# EAGLE schematic MJ838 - rev.1b (EAGLE 9.6.2)
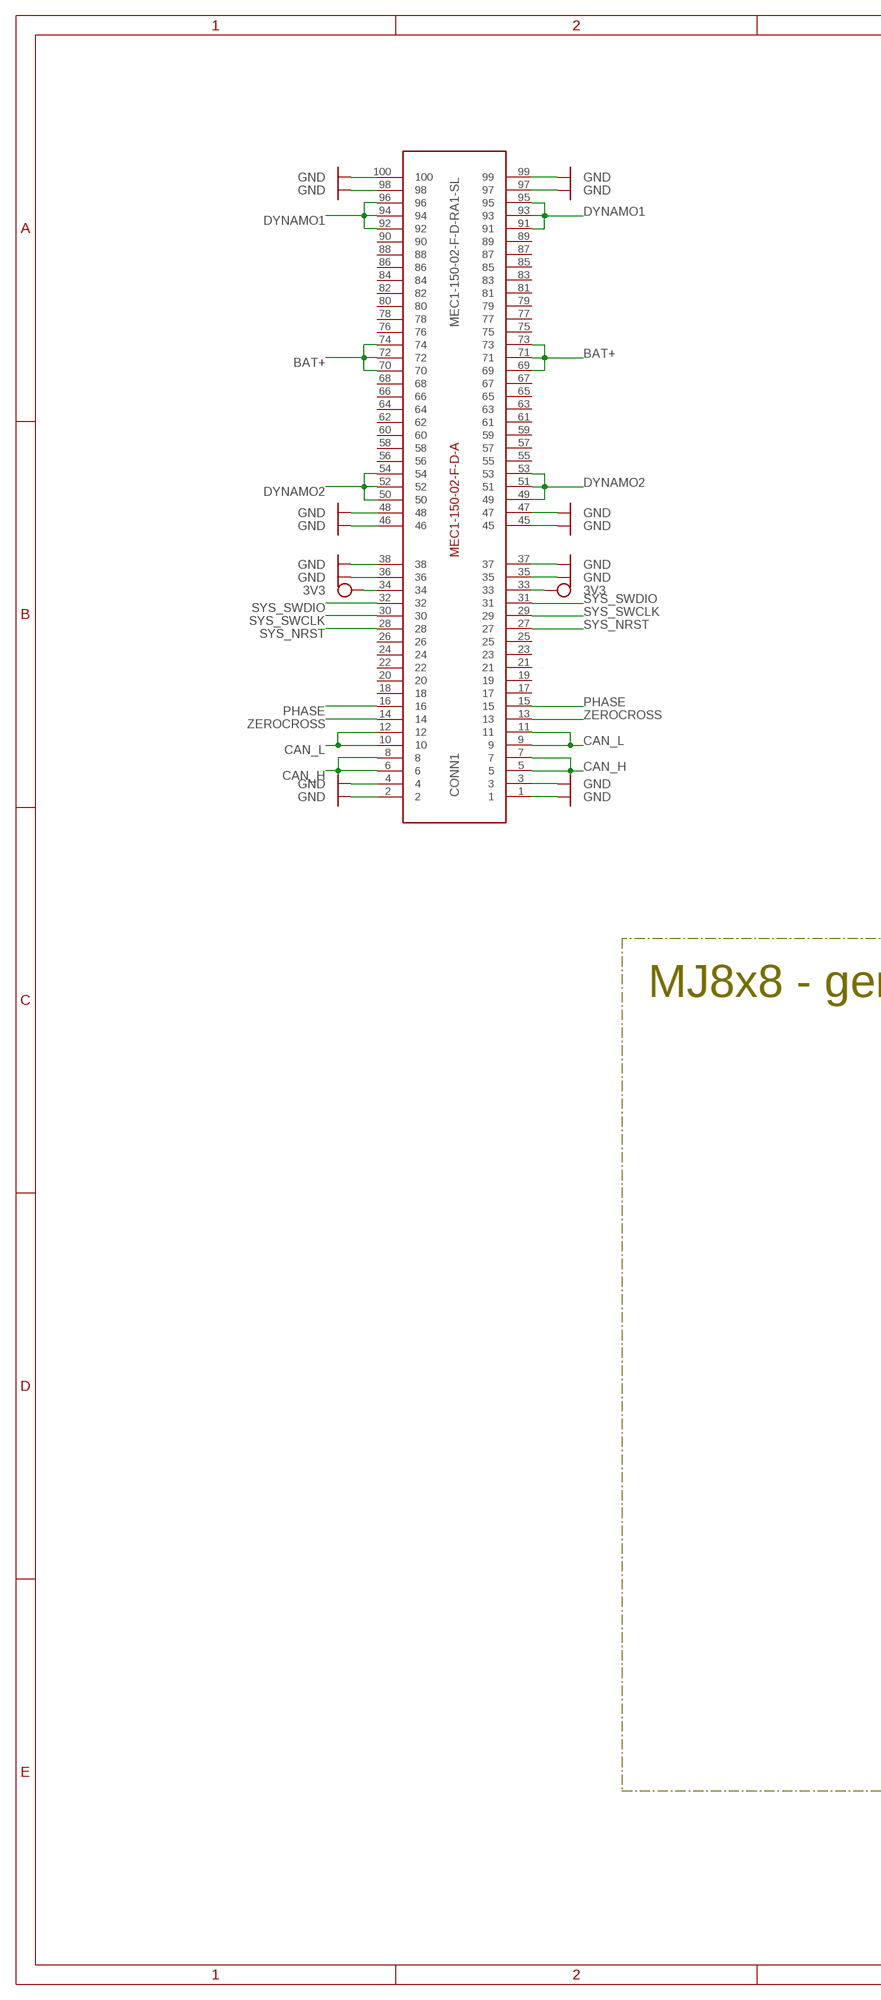
[diagram p0: schematic, sheet 1, part 1 of 2]
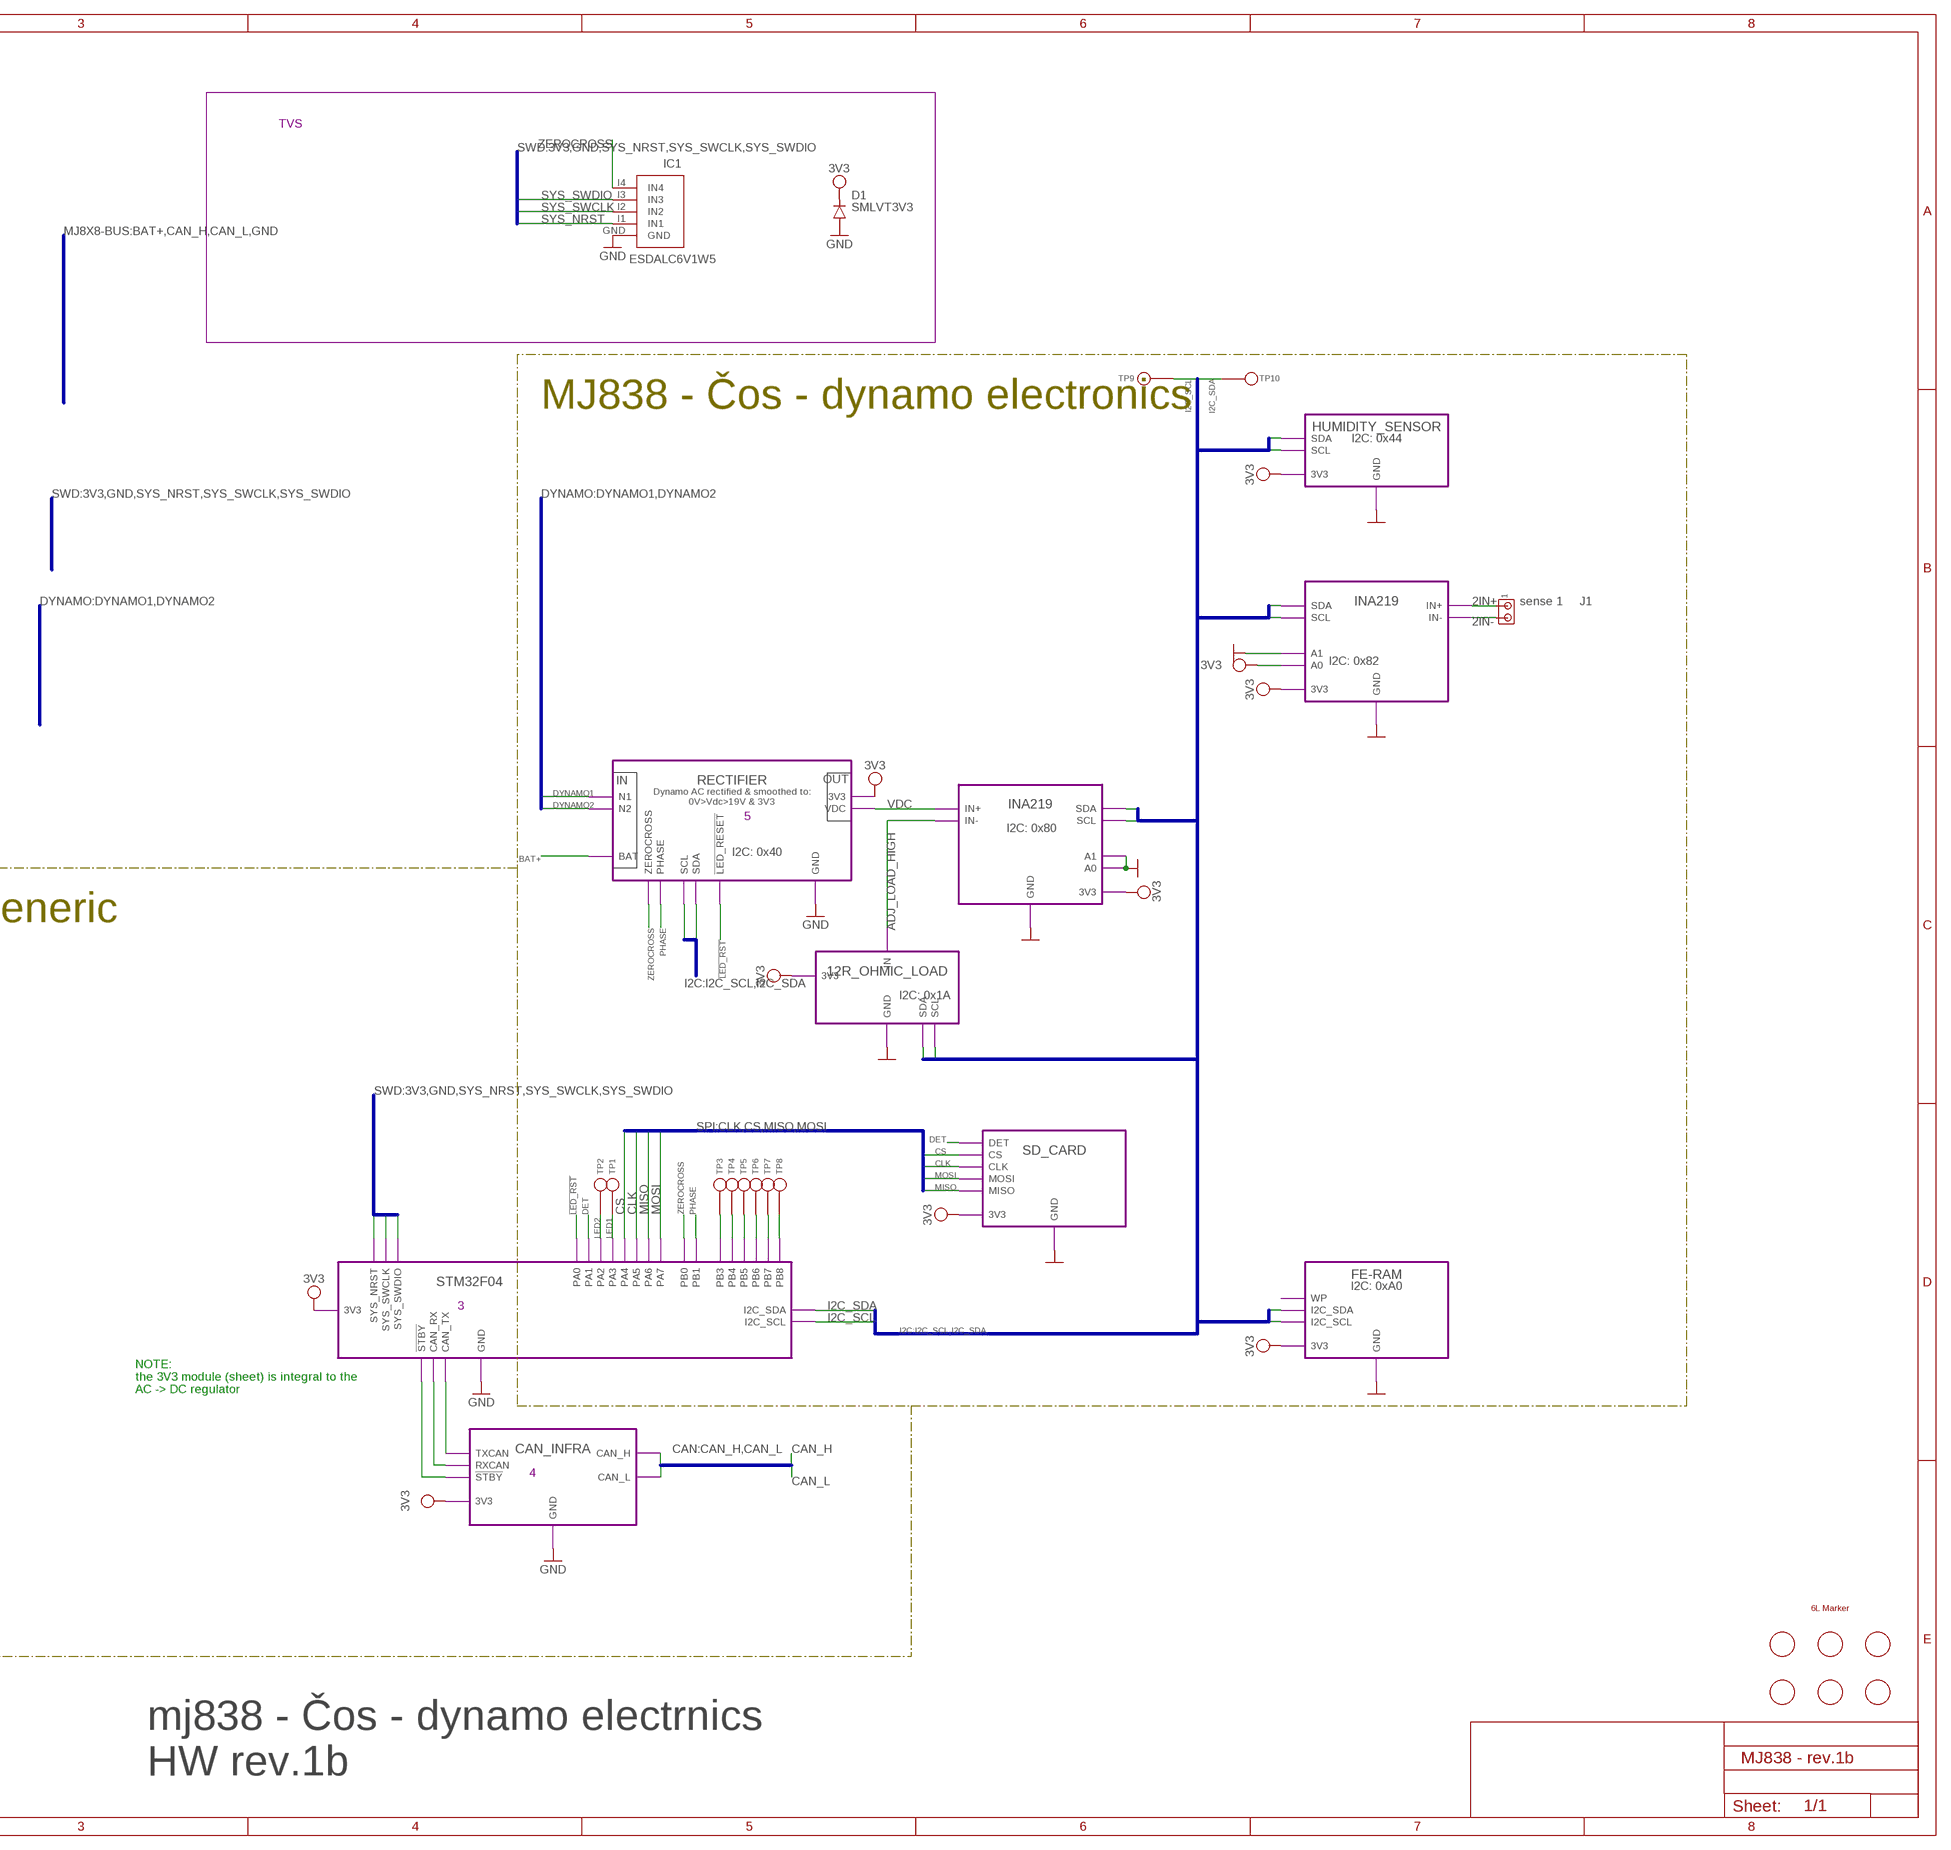
[diagram p1: schematic, sheet 1, part 2 of 2]

## Parts
CONN1  MEC1-150-02-F-D-RA1-SL  CARD-EDGE  [SMD]
D1  SMLVT3V3  DIODE-SMB  [SMB]
FID1  n/a  FIDUCIALFID_1MM  [FIDUCIAL_1MM]
FID2  n/a  FIDUCIALFID_1MM  [FIDUCIAL_1MM]
FID3  n/a  FIDUCIALFID_1MM  [FIDUCIAL_1MM]
FID4  n/a  FIDUCIALFID_1MM  [FIDUCIAL_1MM]
FID5  n/a  FIDUCIALFID_1MM  [FIDUCIAL_1MM]
FID6  n/a  FIDUCIALFID_1MM  [FIDUCIAL_1MM]
IC1  ESDALC6V1W5  ESDALC6  [SOT323-5]
J1  sense 1  MTA02-100  [10X02MTA]
MARKER1  6 layer  6L  [6L]
TP1  CAN high  TPTH-0.9  [TH-0.9]
TP2  CAN high  TPTH-0.9  [TH-0.9]
TP3  CAN high  TPTH-0.9  [TH-0.9]
TP4  CAN high  TPTH-0.9  [TH-0.9]
TP5  CAN high  TPTH-0.9  [TH-0.9]
TP6  CAN high  TPTH-0.9  [TH-0.9]
TP7  CAN high  TPTH-0.9  [TH-0.9]
TP8  CAN high  TPTH-0.9  [TH-0.9]
TP9  CAN high  TPTH-0.9  [TH-0.9]
TP10  CAN high  TPTH-0.9  [TH-0.9]

## Module instances
STM32F04 = STM32
CAN_INFRA = CAN_INFRA
RECTIFIER = RECTIFIER
12R_OHMIC_LOAD = 12R_OHMIC_LOAD
FE-RAM = FE-RAM
HUMIDITY_SENSOR = HUMIDITY
INA219 = INA219
INA1 = INA219
SD_CARD = SD_CARD

## Nets
2IN+ [signal]: J1.1 ; port INA1.IN+
2IN- [signal]: J1.2 ; port INA1.IN-
3V3 [3V3]: CONN1.33 CONN1.34 D1.C ; port STM32F04.3V3 CAN_INFRA.3V3 RECTIFIER.3V3 FE-RAM.3V3 HUMIDITY_SENSOR.3V3 12R_OHMIC_LOAD.3V3 INA219.3V3 INA1.3V3 INA1.A0 SD_CARD.3V3
!LED_RST! [signal]: port RECTIFIER.!LED_RESET! STM32F04.PA0
!STBY! [signal]: port CAN_INFRA.!STBY! STM32F04.!STBY!
ADJ_LOAD_HIGH [Vdc]: port 12R_OHMIC_LOAD.IN INA219.IN-
BAT+ [BAT+]: CONN1.69 CONN1.70 CONN1.71 CONN1.72 CONN1.73 CONN1.74 ; port RECTIFIER.BAT
CAN_H [signal]: CONN1.5 CONN1.6 CONN1.7 CONN1.8 ; port CAN_INFRA.CAN_H
CAN_L [signal]: CONN1.9 CONN1.10 CONN1.11 CONN1.12 ; port CAN_INFRA.CAN_L
CAN_RX [signal]: port CAN_INFRA.RXCAN STM32F04.CAN_RX
CAN_TX [signal]: port CAN_INFRA.TXCAN STM32F04.CAN_TX
CLK: port STM32F04.PA5 SD_CARD.CLK
CS: port STM32F04.PA4 SD_CARD.CS
DET: port SD_CARD.DET STM32F04.PA1
DYNAMO1 [Vdynamo]: CONN1.91 CONN1.92 CONN1.93 CONN1.94 CONN1.95 CONN1.96 ; port RECTIFIER.N1
DYNAMO2 [Vdynamo]: CONN1.49 CONN1.50 CONN1.51 CONN1.52 CONN1.53 CONN1.54 ; port RECTIFIER.N2
GND: CONN1.1 CONN1.2 CONN1.3 CONN1.4 CONN1.35 CONN1.36 CONN1.37 CONN1.38 CONN1.45 CONN1.46 CONN1.47 CONN1.48 CONN1.97 CONN1.98 CONN1.99 CONN1.100 D1.A IC1.GND ; port STM32F04.GND CAN_INFRA.GND RECTIFIER.GND 12R_OHMIC_LOAD.GND FE-RAM.GND HUMIDITY_SENSOR.GND INA219.GND INA219.A1 INA219.A0 INA1.GND INA1.A1 SD_CARD.GND
I2C_SCL [signal]: TP9.P$1(TP$1) ; port FE-RAM.I2C_SCL STM32F04.I2C_SCL HUMIDITY_SENSOR.SCL RECTIFIER.SCL 12R_OHMIC_LOAD.SCL INA219.SCL INA1.SCL
I2C_SDA [signal]: TP10.P$1(TP$1) ; port FE-RAM.I2C_SDA STM32F04.I2C_SDA HUMIDITY_SENSOR.SDA RECTIFIER.SDA 12R_OHMIC_LOAD.SDA INA219.SDA INA1.SDA
LED1: TP1.P$1(TP$1) ; port STM32F04.PA3
LED2: TP2.P$1(TP$1) ; port STM32F04.PA2
MISO: port STM32F04.PA6 SD_CARD.MISO
MOSI: port STM32F04.PA7 SD_CARD.MOSI
PB3: TP3.P$1(TP$1) ; port STM32F04.PB3
PB4: TP4.P$1(TP$1) ; port STM32F04.PB4
PB5: TP5.P$1(TP$1) ; port STM32F04.PB5
PB6: TP6.P$1(TP$1) ; port STM32F04.PB6
PB7: TP7.P$1(TP$1) ; port STM32F04.PB7
PB8: TP8.P$1(TP$1) ; port STM32F04.PB8
PHASE [signal]: CONN1.15 CONN1.16 ; port RECTIFIER.PHASE STM32F04.PB1
SYS_NRST [signal]: CONN1.27 CONN1.28 IC1.I1(IN1) ; port STM32F04.SYS_NRST
SYS_SWCLK [signal]: CONN1.29 CONN1.30 IC1.I2(IN2) ; port STM32F04.SYS_SWCLK
SYS_SWDIO [signal]: CONN1.31 CONN1.32 IC1.I3(IN3) ; port STM32F04.SYS_SWDIO
VDC [Vdc]: port RECTIFIER.VDC INA219.IN+
ZEROCROSS [signal]: CONN1.13 CONN1.14 IC1.I4(IN4) ; port STM32F04.PB0 RECTIFIER.ZEROCROSS
Unconnected: CONN1.17 CONN1.18 CONN1.19 CONN1.20 CONN1.21 CONN1.22 CONN1.23 CONN1.24 CONN1.25 CONN1.26 CONN1.55 CONN1.56 CONN1.57 CONN1.58 CONN1.59 CONN1.60 CONN1.61 CONN1.62 CONN1.63 CONN1.64 CONN1.65 CONN1.66 CONN1.67 CONN1.68 CONN1.75 CONN1.76 CONN1.77 CONN1.78 CONN1.79 CONN1.80 CONN1.81 CONN1.82 CONN1.83 CONN1.84 CONN1.85 CONN1.86 CONN1.87 CONN1.88 CONN1.89 CONN1.90

## Buses
CAN:CAN_H,CAN_L
SWD:3V3,GND,SYS_NRST,SYS_SWCLK,SYS_SWDIO
I2C:I2C_SCL,I2C_SDA
MJ8X8-BUS:BAT+,CAN_H,CAN_L,GND
DYNAMO:DYNAMO1,DYNAMO2
SPI:CLK,CS,MISO,MOSI

## Notes on the sheet
- TVS
- MJ838 - Čos - dynamo electronics
- I2C: 0x44
- I2C: 0x82
- IN | OUT
- Dynamo AC rectified & smoothed to:
  0V>Vdc>19V & 3V3
- 5
- I2C: 0x80
- I2C: 0x40
- MJ8x8 - generic
- I2C: 0x1A
- I2C: 0xA0
- 3
- NOTE:
  the 3V3 module (sheet) is integral to the
  AC -> DC regulator
- 4
- mj838 - Čos - dynamo electrnics
  HW rev.1b

## Library data of the parts
CONN1 = Samtec MEC1 - Card Edge Connector:CARD-EDGE
D1 = diode:DIODE-: DIODE
FID1-FID6 = fiducials:FIDUCIAL
IC1 = ESDALCx - 4c ESD protection:ESDALC6
J1 = con-amp:MTA02-100: AMP connector
MARKER1 = Layer Markers:6L
TP1-TP10 = signal testpoint:TP

## Module STM32
Ports: GND(pwr) 3V3(pwr) SYS_NRST(in) SYS_SWCLK(io) SYS_SWDIO(io) CAN_RX(in) CAN_TX(out) !STBY!(out) I2C_SCL(out) I2C_SDA(io) PB1(in) PB3(io) PB4(io) PB5(io) PB6(io) PB7(io) PB8(io) PB0(in) PA0(out) PA1(io) PA7(out) PA2(io) PA3(io) PA4(io) PA5(io) PA6(io)
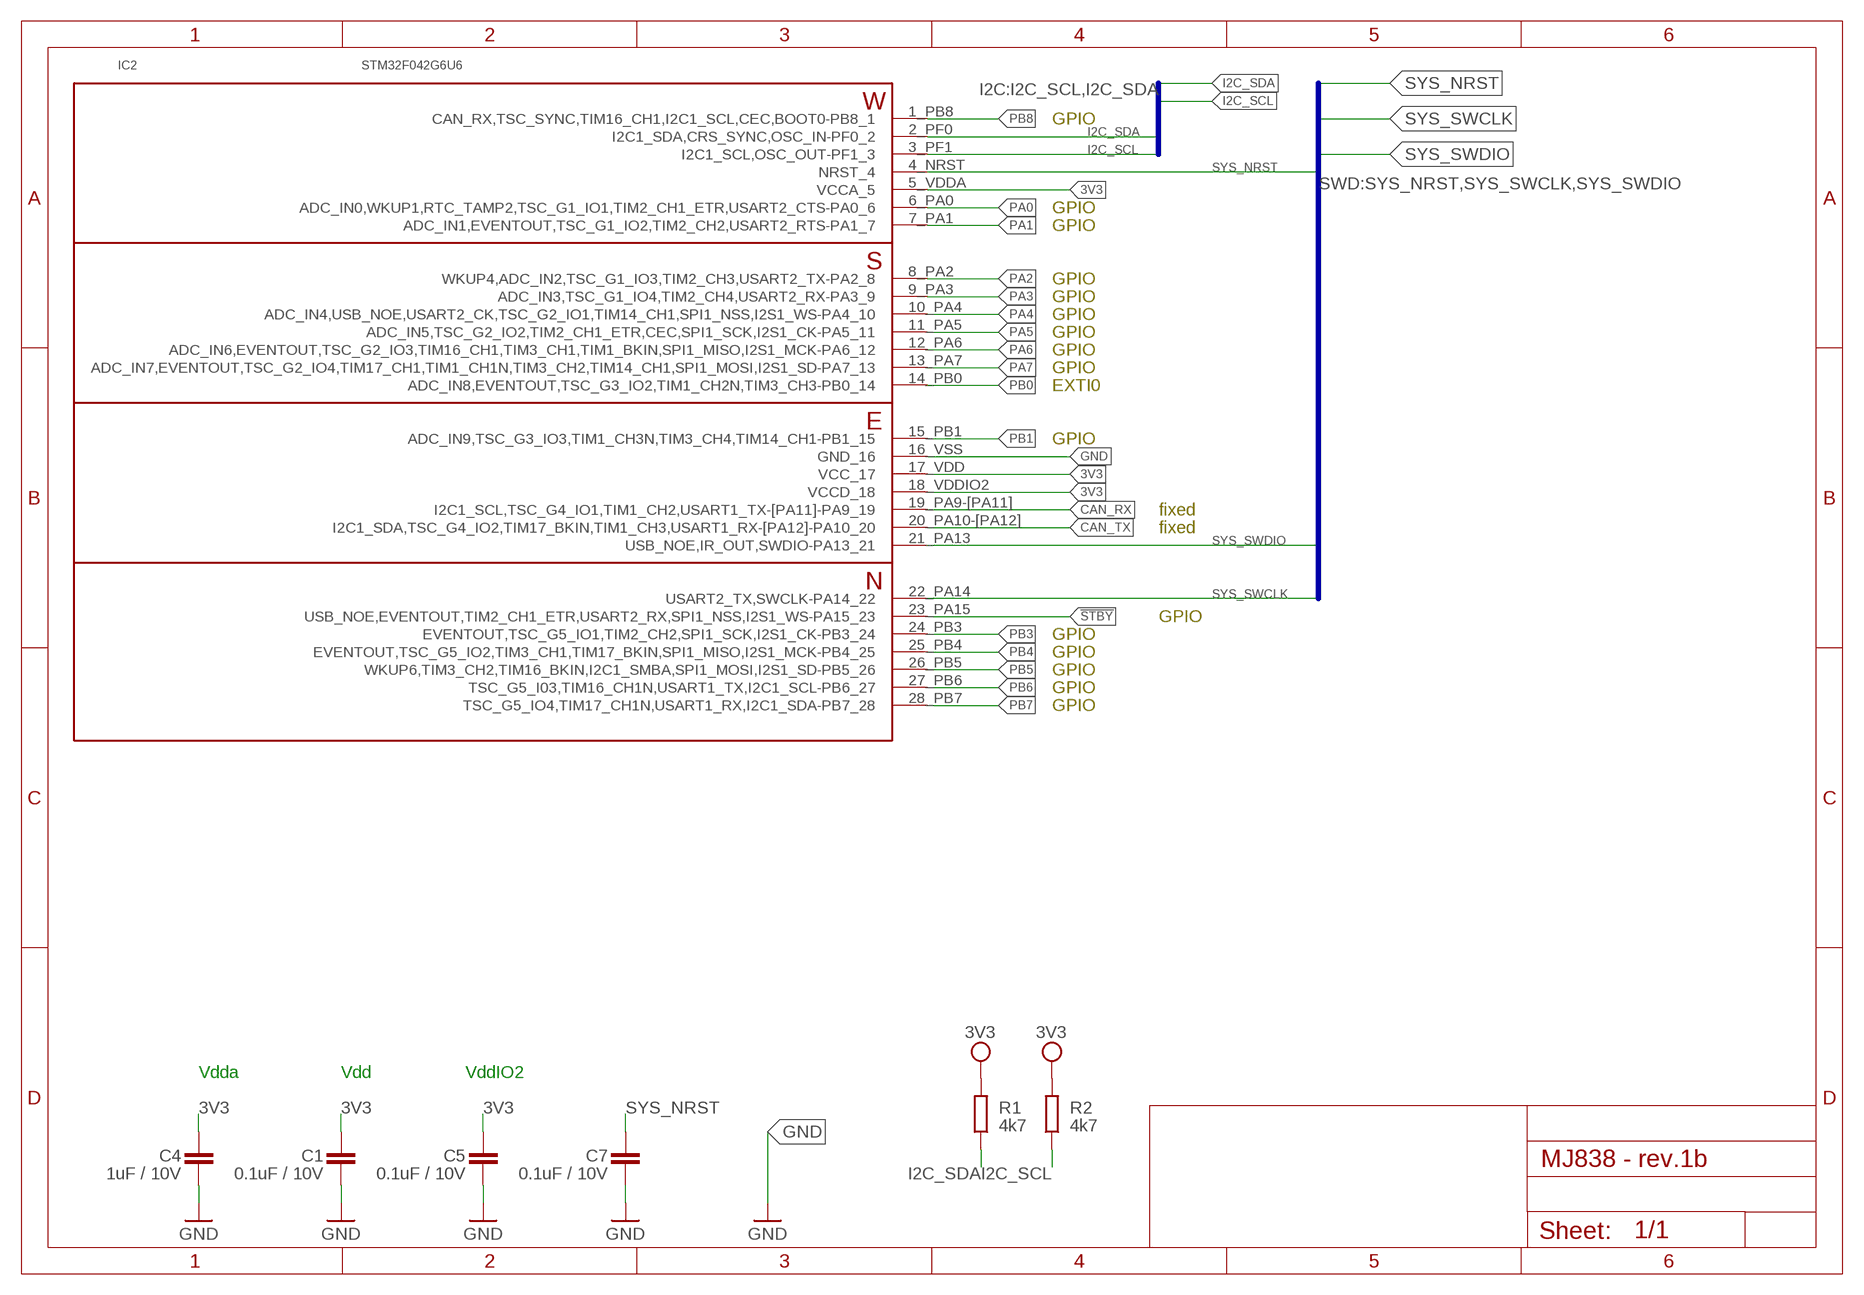
[diagram p2: schematic, module STM32, sheet 1]

### Parts
C1  0.1uF / 10V  C-EUC0402  [C0402]
C4  1uF / 10V  C-EUC0402  [C0402]
C5  0.1uF / 10V  C-EUC0402  [C0402]
C7  0.1uF / 10V  C-EUC0402  [C0402]
IC2  STM32F042G6U6  STM32F042G6  [UFQFPN-28]
R1  4k7  R-EU_R0402  [R0402]
R2  4k7  R-EU_R0402  [R0402]

### Nets
3V3 [3V3]: C1.2 C4.2 C5.2 IC2.5_VDDA(VCCA_5) IC2.17_VDD(VCC_17) IC2.18_VDDIO2(VCCD_18) R1.2 R2.2
!STBY! [signal]: IC2.23_PA15(USB_NOE,EVENTOUT,TIM2_CH1_ETR,USART2_RX,SPI1_NSS,I2S1_WS-PA15_23)
CAN_RX [signal]: IC2.19_PA9-[PA11](I2C1_SCL,TSC_G4_IO1,TIM1_CH2,USART1_TX-[PA11]-PA9_19)
CAN_TX [signal]: IC2.20_PA10-[PA12](I2C1_SDA,TSC_G4_IO2,TIM17_BKIN,TIM1_CH3,USART1_RX-[PA12]-PA10_20)
GND: C1.1 C4.1 C5.1 C7.1 IC2.16_VSS(GND_16)
I2C_SCL [signal]: IC2.3_PF1(I2C1_SCL,OSC_OUT-PF1_3) R2.1
I2C_SDA [signal]: IC2.2_PF0(I2C1_SDA,CRS_SYNC,OSC_IN-PF0_2) R1.1
PA0 [signal]: IC2.6_PA0(ADC_IN0,WKUP1,RTC_TAMP2,TSC_G1_IO1,TIM2_CH1_ETR,USART2_CTS-PA0_6)
PA1 [signal]: IC2.7_PA1(ADC_IN1,EVENTOUT,TSC_G1_IO2,TIM2_CH2,USART2_RTS-PA1_7)
PA2 [signal]: IC2.8_PA2(WKUP4,ADC_IN2,TSC_G1_IO3,TIM2_CH3,USART2_TX-PA2_8)
PA3 [signal]: IC2.9_PA3(ADC_IN3,TSC_G1_IO4,TIM2_CH4,USART2_RX-PA3_9)
PA4 [signal]: IC2.10_PA4(ADC_IN4,USB_NOE,USART2_CK,TSC_G2_IO1,TIM14_CH1,SPI1_NSS,I2S1_WS-PA4_10)
PA5 [signal]: IC2.11_PA5(ADC_IN5,TSC_G2_IO2,TIM2_CH1_ETR,CEC,SPI1_SCK,I2S1_CK-PA5_11)
PA6 [signal]: IC2.12_PA6(ADC_IN6,EVENTOUT,TSC_G2_IO3,TIM16_CH1,TIM3_CH1,TIM1_BKIN,SPI1_MISO,I2S1_MCK-PA6_12)
PA7 [signal]: IC2.13_PA7(ADC_IN7,EVENTOUT,TSC_G2_IO4,TIM17_CH1,TIM1_CH1N,TIM3_CH2,TIM14_CH1,SPI1_MOSI,I2S1_SD-PA7_13)
PB0 [signal]: IC2.14_PB0(ADC_IN8,EVENTOUT,TSC_G3_IO2,TIM1_CH2N,TIM3_CH3-PB0_14)
PB1 [signal]: IC2.15_PB1(ADC_IN9,TSC_G3_IO3,TIM1_CH3N,TIM3_CH4,TIM14_CH1-PB1_15)
PB3 [signal]: IC2.24_PB3(EVENTOUT,TSC_G5_IO1,TIM2_CH2,SPI1_SCK,I2S1_CK-PB3_24)
PB4 [signal]: IC2.25_PB4(EVENTOUT,TSC_G5_IO2,TIM3_CH1,TIM17_BKIN,SPI1_MISO,I2S1_MCK-PB4_25)
PB5 [signal]: IC2.26_PB5(WKUP6,TIM3_CH2,TIM16_BKIN,I2C1_SMBA,SPI1_MOSI,I2S1_SD-PB5_26)
PB6 [signal]: IC2.27_PB6(TSC_G5_I03,TIM16_CH1N,USART1_TX,I2C1_SCL-PB6_27)
PB7 [signal]: IC2.28_PB7(TSC_G5_IO4,TIM17_CH1N,USART1_RX,I2C1_SDA-PB7_28)
PB8 [signal]: IC2.1_PB8(CAN_RX,TSC_SYNC,TIM16_CH1,I2C1_SCL,CEC,BOOT0-PB8_1)
SYS_NRST [signal]: C7.2 IC2.4_NRST(NRST_4)
SYS_SWCLK [signal]: IC2.22_PA14(USART2_TX,SWCLK-PA14_22)
SYS_SWDIO [signal]: IC2.21_PA13(USB_NOE,IR_OUT,SWDIO-PA13_21)

### Buses
SWD:SYS_NRST,SYS_SWCLK,SYS_SWDIO
I2C:I2C_SCL,I2C_SDA

### Notes on the sheet
- GPIO
- GPIO
- GPIO
- GPIO
- GPIO
- GPIO
- GPIO
- GPIO
- GPIO
- EXTI0
- GPIO
- fixed
- fixed
- GPIO
- GPIO
- GPIO
- GPIO
- GPIO
- GPIO
- Vdda | Vdd | VddIO2

### Library data of the parts
C1 C4 C5 C7 = rcl:C-EU: CAPACITOR, European symbol; SPICEPREFIX: C
IC2 = STM32F042G6:STM32F042G6
R1 R2 = rcl:R-EU_: RESISTOR, European symbol; SPICEPREFIX: R

## Module CAN_INFRA
Ports: GND(pwr) 3V3(pwr) CAN_H(io) CAN_L(io) TXCAN(in) RXCAN(out) !STBY!(in)
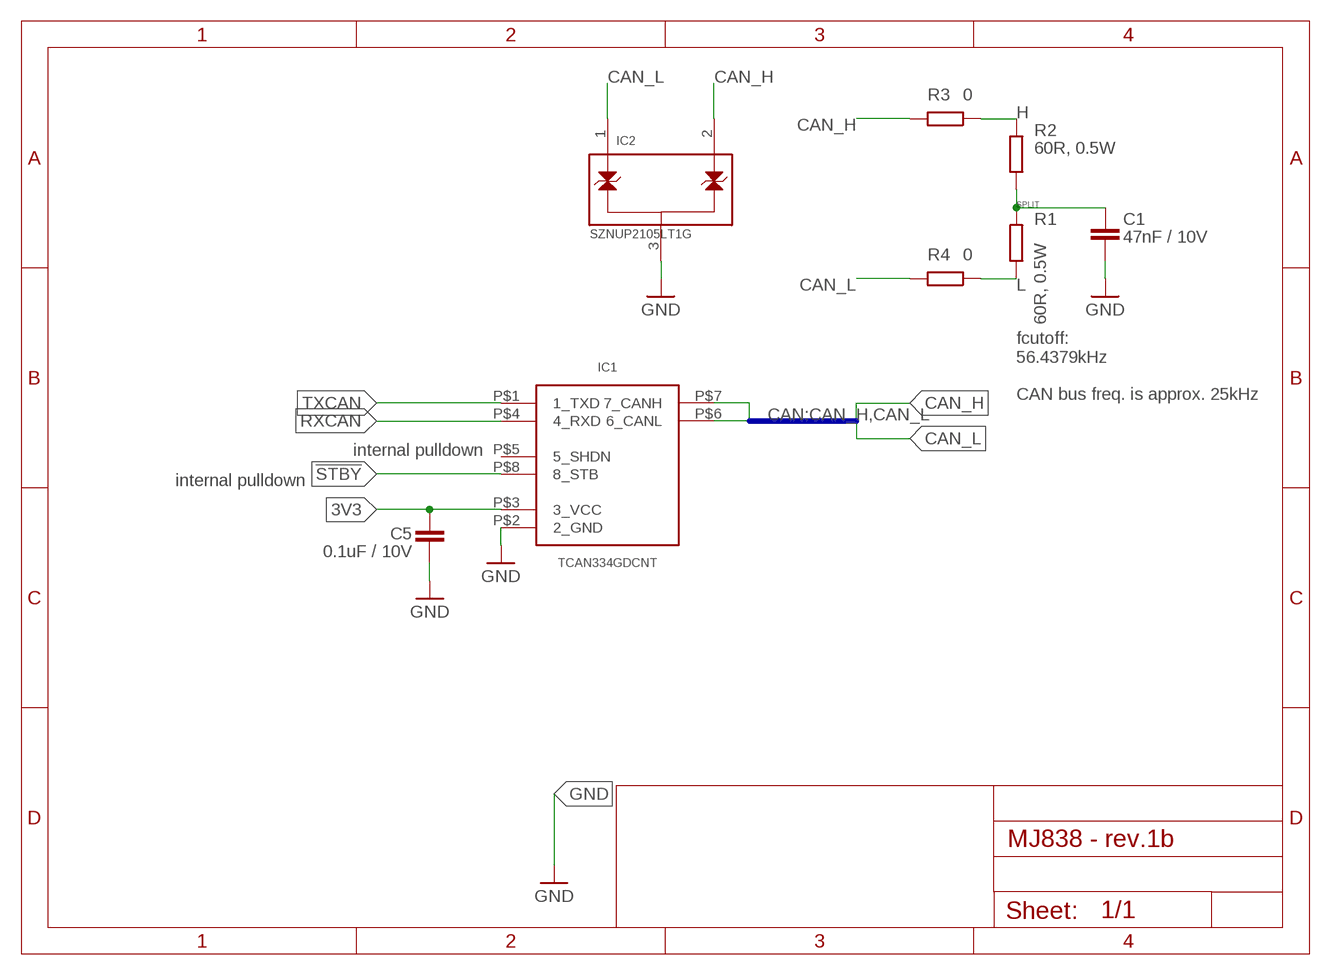
[diagram p3: schematic, module CAN_INFRA, sheet 1]

### Parts
C1  47nF / 10V  C-EUC0402  [C0402]
C5  0.1uF / 10V  C-EUC0402  [C0402]
IC1  TCAN334GDCNT  CAN33X  [SOT23-8]
IC2  SZNUP2105LT1G  NUP2105L  [SOT-23-3]
R1  60R, 0.5W  R-EU_R0805  [R0805]
R2  60R, 0.5W  R-EU_R0805  [R0805]
R3  0  R-EU_R0402  [R0402]
R4  0  R-EU_R0402  [R0402]

### Nets
3V3 [3V3]: C5.1 IC1.P$3(3_VCC)
!STBY! [signal]: IC1.P$8(8_STB)
CAN_H [signal]: IC1.P$7(7_CANH) IC2.2(PIN2) R3.2
CAN_L [signal]: IC1.P$6(6_CANL) IC2.1(PIN1) R4.2
GND: C1.2 C5.2 IC1.P$2(2_GND) IC2.3(PIN3)
H [signal]: R2.2 R3.1
L [signal]: R1.1 R4.1
RXCAN [signal]: IC1.P$4(4_RXD)
SPLIT [signal]: C1.1 R1.2 R2.1
TXCAN [signal]: IC1.P$1(1_TXD)
Unconnected: IC1.P$5(5_SHDN)

### Buses
CAN:CAN_H,CAN_L

### Notes on the sheet
- fcutoff:
  56.4379kHz
  
  CAN bus freq. is approx. 25kHz
- internal pulldown
- internal pulldown

### Library data of the parts
C1 C5 = rcl:C-EU: CAPACITOR, European symbol; SPICEPREFIX: C
IC1 = TCAN33x - 3.3V CAN Transciever:CAN33X
IC2 = NUP2105L - 27V ESD Protection Diode:NUP2105L
R1-R4 = rcl:R-EU_: RESISTOR, European symbol; SPICEPREFIX: R

## Module ZERO-CROSS_DETECTOR
Ports: GND(pwr) OUT(out) 3V3(pwr) AC(in)
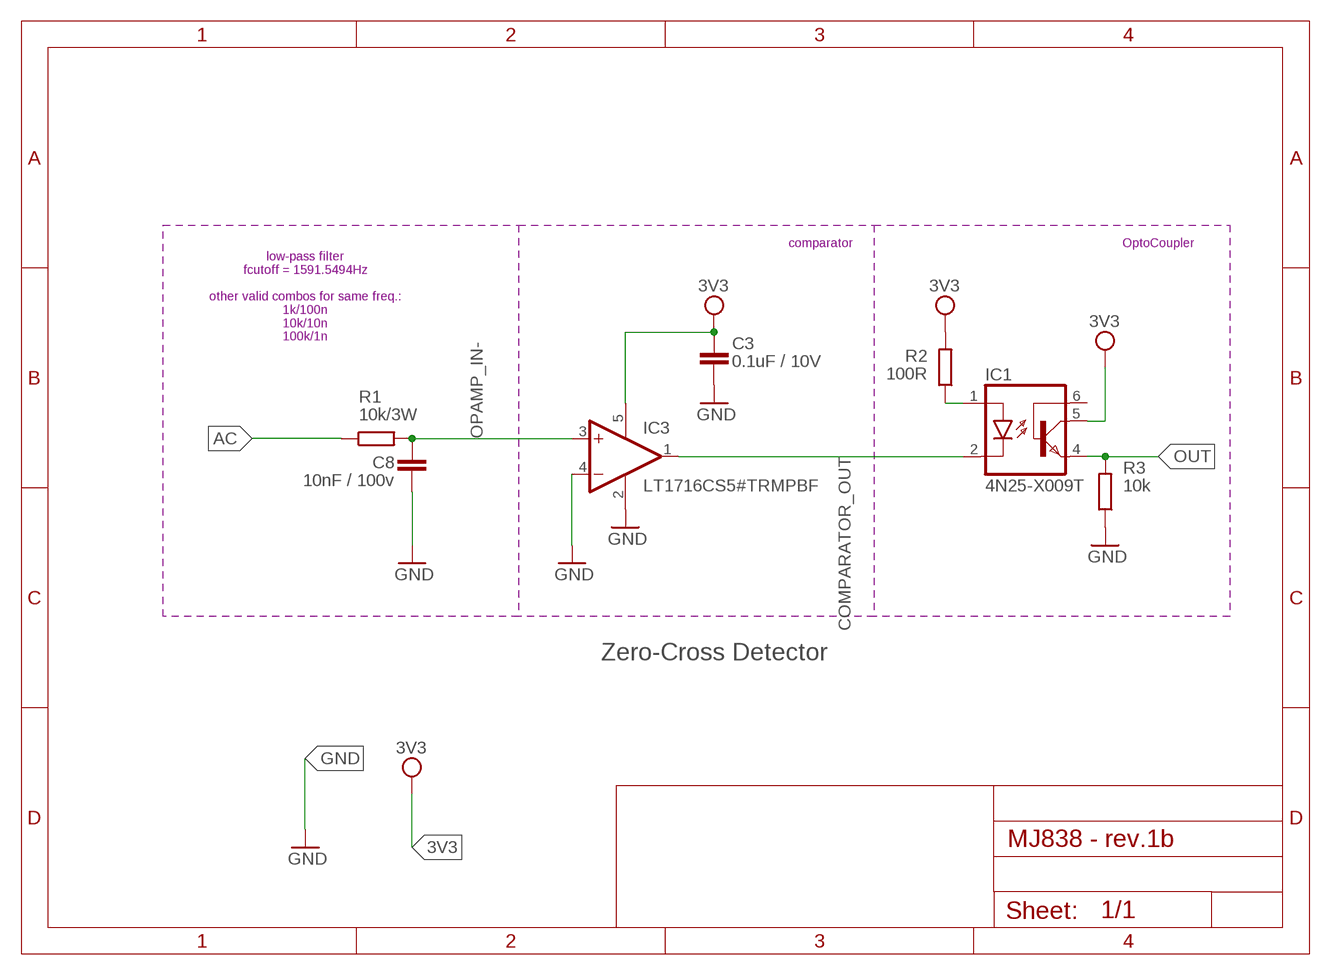
[diagram p4: schematic, module ZERO-CROSS_DETECTOR, sheet 1]

### Parts
C3  0.1uF / 10V  C-EUC0402  [C0402]
C8  10nF / 100v  C-EUC1812  [C1812]
IC1  4N25-X009T  4N25  [SMD-6]
IC3  LT1716CS5#TRMPBF  OPA344N-SOT23  [SOT23-5]
R1  10k/3W  R-EU_R2512  [R2512]
R2  100R  R-EU_R0402  [R0402]
R3  10k  R-EU_R0402  [R0402]

### Nets
3V3 [3V3]: C3.2 IC1.5(COLLECTOR) IC3.5(V+) R2.2
AC [Vdynamo]: R1.1
COMPARATOR_OUT [signal]: IC1.2(CATHODE) IC3.1(OUT)
GND: C3.1 C8.1 IC3.2(V-) IC3.4(-IN) R3.1
OPAMP_IN- [Vdynamo]: C8.2 IC3.3(+IN) R1.2
OPTO-ANODE [signal]: IC1.1(ANODE) R2.1
OUT [signal]: IC1.4(EMITTER) R3.2
Unconnected: IC1.6(BASE)

### Notes on the sheet
- comparator | OptoCoupler
- low-pass filter
  fcutoff = 1591.5494Hz
  
  other valid combos for same freq.:
  1k/100n
  10k/10n
  100k/1n
- Zero-Cross Detector

### Library data of the parts
C3 C8 = rcl:C-EU: CAPACITOR, European symbol; SPICEPREFIX: C
IC1 = 4N25 - OpoCoupler:4N25
IC3 = linear:OPA*-SOT23: Single Operational Amplifier Low Power, Single-Supply, Rail-To-Rail Operational Amplifier Source: http://focus.ti.com/lit/ds/symlink/opa2345.pdf
R1-R3 = rcl:R-EU_: RESISTOR, European symbol; SPICEPREFIX: R

## Module 3V3
Ports: GND(pwr) VIN(pwr) 3V3(pwr)
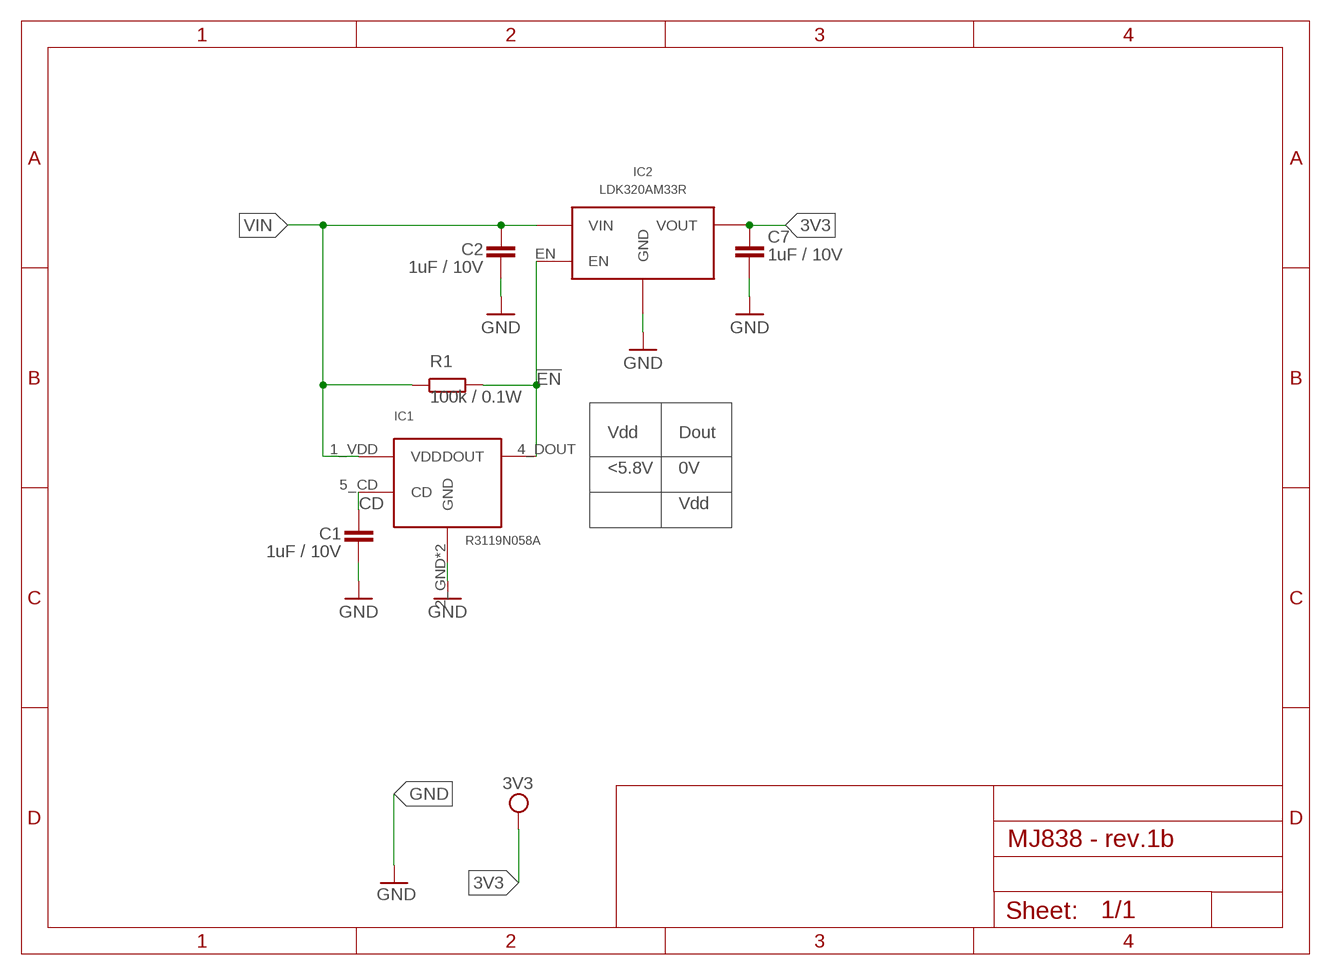
[diagram p5: schematic, module 3V3, sheet 1]

### Parts
C1  1uF / 10V  C-EUC0402  [C0402]
C2  1uF / 10V  C-EUC0402  [C0402]
C7  1uF / 10V  C-EUC0402  [C0402]
IC1  R3119N058A  R3119XXXA  [SOT23-5]
IC2  LDK320AM33R  LDK320SOT-23-5L  [SOT-23-5L]
R1  100k / 0.1W  R-EU_R0402  [R0402]

### Nets
3V3 [3V3]: C7.2 IC2.OUT(VOUT)
!EN! [Vdc]: IC1.4_DOUT(DOUT) IC2.EN R1.2
CD [3V3]: C1.1 IC1.5_CD(CD)
GND: C1.2 C2.2 C7.1 IC1.2_GND(GND) IC1.3_GND(GND) IC2.GND
VIN [Vdc]: C2.1 IC1.1_VDD(VDD) IC2.IN(VIN) R1.1

### Notes on the sheet
- Vdd | Dout
- <5.8V | 0V
- Vdd

### Library data of the parts
C1 C2 C7 = rcl:C-EU: CAPACITOR, European symbol; SPICEPREFIX: C
IC1 = R3119x - Input Voltage Detector:R3119XXXA
IC2 = LDK320 5V LDO:LDK320
R1 = rcl:R-EU_: RESISTOR, European symbol; SPICEPREFIX: R

## Module SMOOTHING_CAP
Ports: GND(pwr) VIN(pwr) VOUT(pwr)
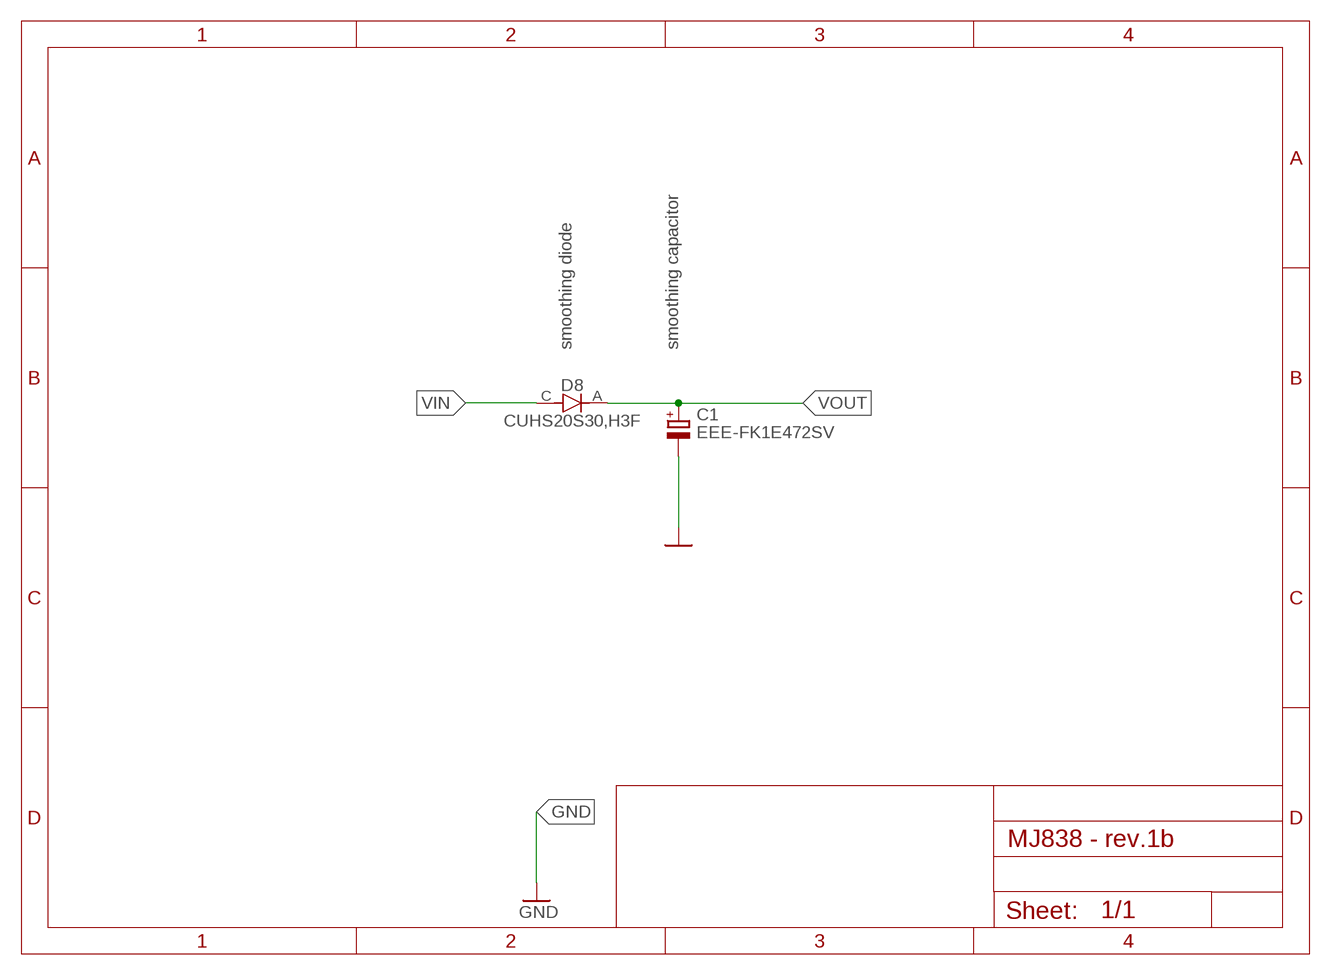
[diagram p6: schematic, module SMOOTHING_CAP, sheet 1]

### Parts
C1  EEE-FK1E472SV  EEEFK1E472SV  [CAP_EEEFK1E472SV]
D8  CUHS20S30,H3F  CUHS20S30  [US2H]

### Nets
GND: C1.-
VIN [Vac]: D8.C
VOUT [Vdc]: C1.+ D8.A

### Notes on the sheet
- smoothing diode | smoothing capacitor

### Library data of the parts
C1 = EEEFK1E472SV:EEEFK1E472SV: Check availability <https://pricing.snapeda.com/parts/EEE-FK1E472SV/Panasonic%20Electronic/view-part?ref=eda>; AVAILABILITY: In Stock; CHECK_PRICES: https://www.snapeda.com/parts/EEE-FK1E472SV/Panasonic/view-part/?ref=eda; DESCRIPTION: Cap Aluminum Lytic 4700uF 25V 20% (18 X 21.5mm) SMD 2640mA 5000h 105C Automotive T/R; MF: Panasonic Electronic; MP: EEE-FK1E472SV; PACKAGE: RADIAL-2 Panasonic; PRICE: None; SNAPEDA_LINK: https://www.snapeda.com/parts/EEE-FK1E472SV/Panasonic/view-part/?ref=snap
D8 = CUHS20S30 - Schottky Barrier Diode:CUHS20S30

## Module ATM_NOT_USED
Ports: SSR_ANODE(pwr) SW1_IN(hiz) SW2_IN(hiz) SW1_OUT(hiz) SW2_OUT(hiz) SW1_CAT(in) SW2_CAT(in)
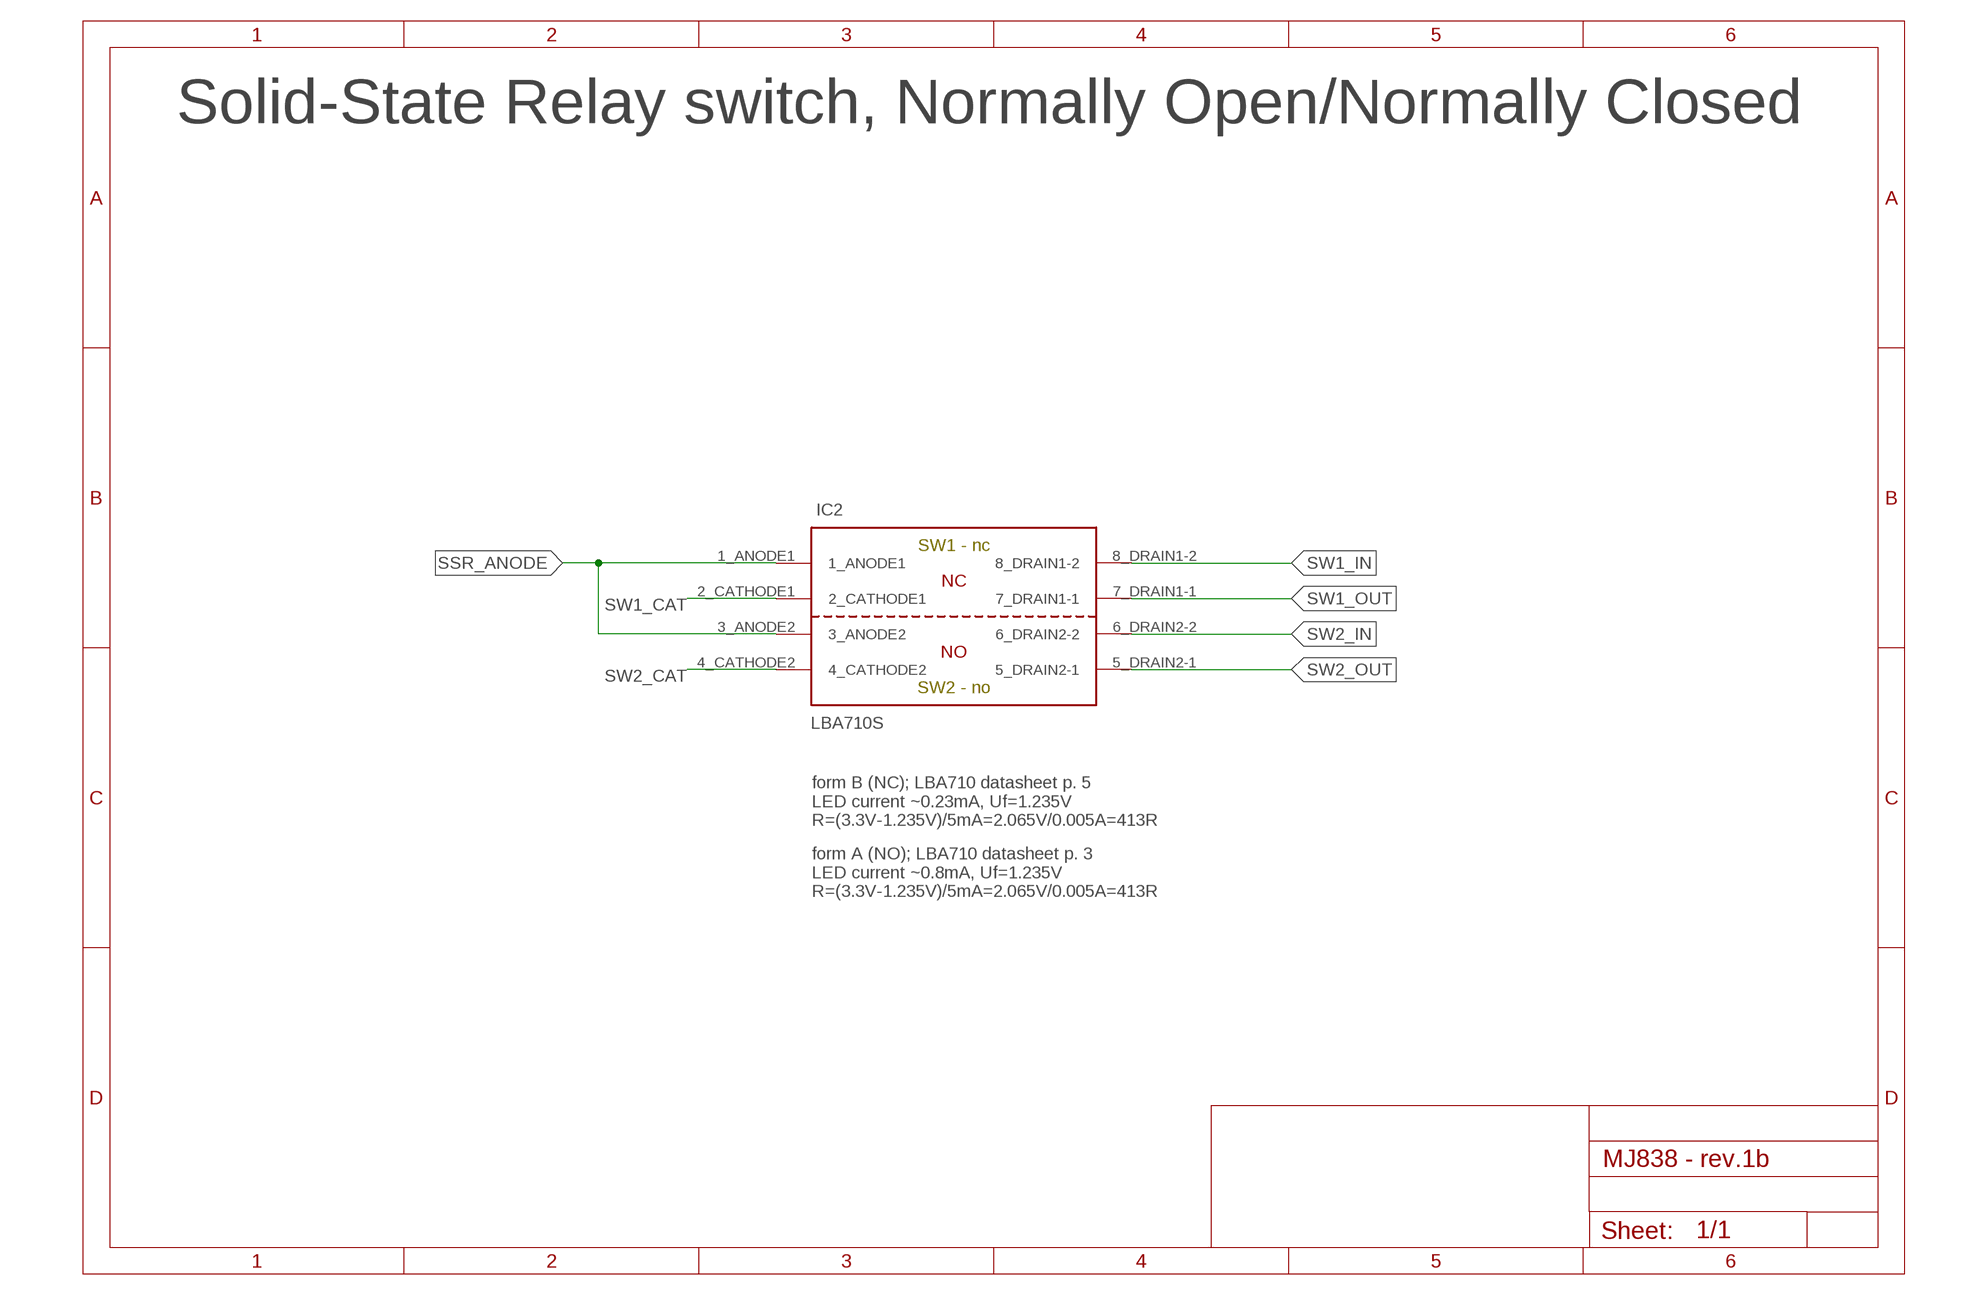
[diagram p7: schematic, module ATM_NOT_USED, sheet 1]

### Parts
IC2  LBA710S  LBA710  [SMD_DIP8]

### Nets
SSR_ANODE [3V3]: IC2.1_ANODE1 IC2.3_ANODE2
SW1_CAT [3V3]: IC2.2_CATHODE1
SW1_IN [BAT+]: IC2.8_DRAIN1-2
SW1_OUT [BAT+]: IC2.7_DRAIN1-1
SW2_CAT [3V3]: IC2.4_CATHODE2
SW2_IN [BAT+]: IC2.6_DRAIN2-2
SW2_OUT [BAT+]: IC2.5_DRAIN2-1

### Notes on the sheet
- Solid-State Relay switch, Normally Open/Normally Closed
- SW1 - nc
- SW2 - no
- form B (NC); LBA710 datasheet p. 5
  LED current ~0.23mA, Uf=1.235V
  R=(3.3V-1.235V)/5mA=2.065V/0.005A=413R
- form A (NO); LBA710 datasheet p. 3
  LED current ~0.8mA, Uf=1.235V
  R=(3.3V-1.235V)/5mA=2.065V/0.005A=413R

### Library data of the parts
IC2 = LxA710 - Solid State Relay Form A-AB:LBA710

## Module SSR_NO/NO
Ports: SSR_ANODE(pwr) SW1_IN(hiz) SW1_OUT(hiz) SW2_IN(hiz) SW2_OUT(hiz) SW1_CAT(in) SW2_CAT(in)
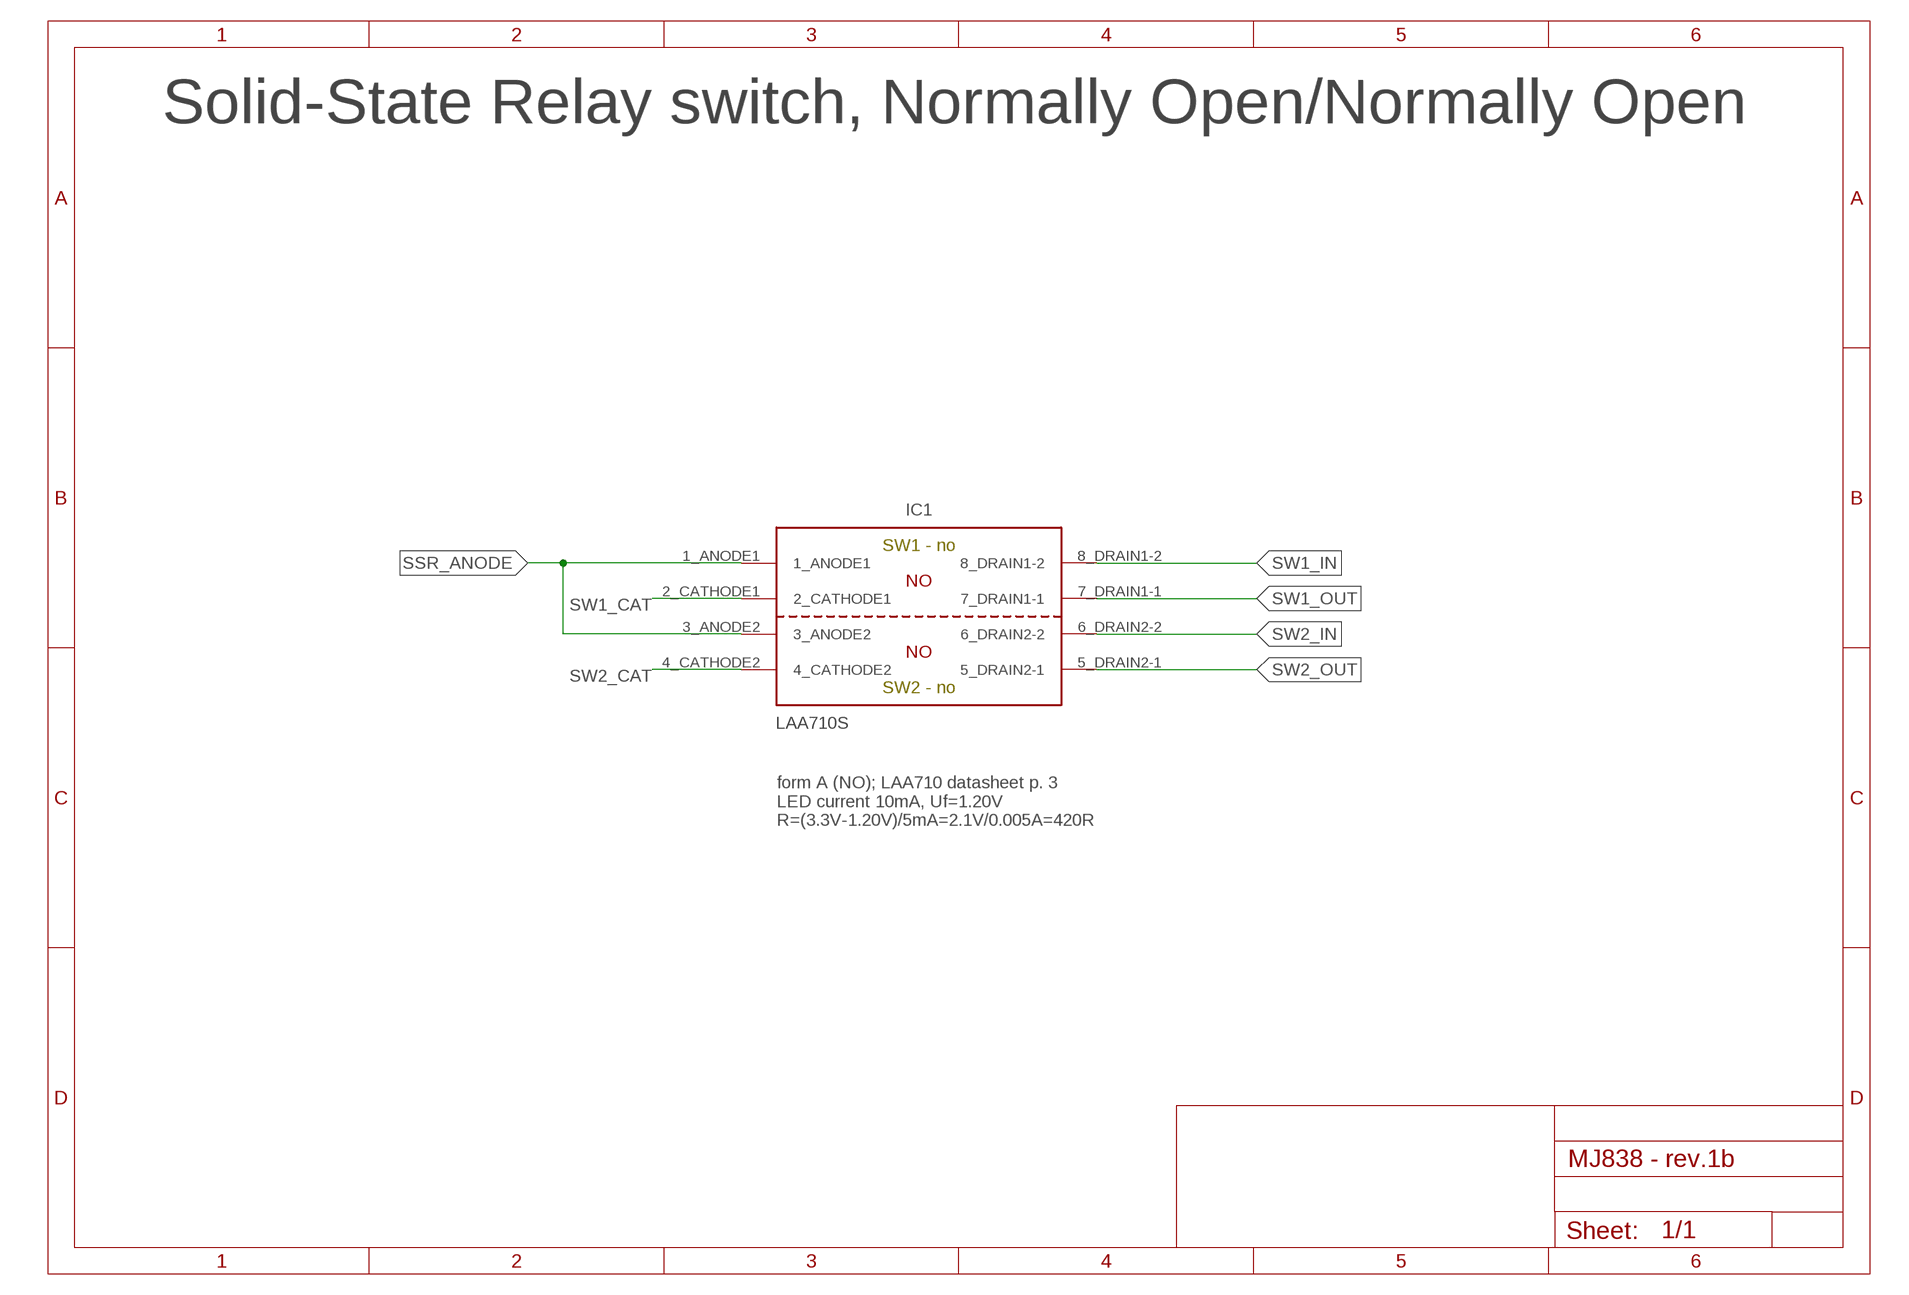
[diagram p8: schematic, module SSR_NO/NO, sheet 1]

### Parts
IC1  LAA710S  LAA710  [SMD_DIP8]

### Nets
SSR_ANODE [3V3]: IC1.1_ANODE1 IC1.3_ANODE2
SW1_CAT [3V3]: IC1.2_CATHODE1
SW1_IN [BAT+]: IC1.8_DRAIN1-2
SW1_OUT [BAT+]: IC1.7_DRAIN1-1
SW2_CAT [3V3]: IC1.4_CATHODE2
SW2_IN [BAT+]: IC1.6_DRAIN2-2
SW2_OUT [BAT+]: IC1.5_DRAIN2-1

### Notes on the sheet
- Solid-State Relay switch, Normally Open/Normally Open
- SW1 - no
- SW2 - no
- form A (NO); LAA710 datasheet p. 3
  LED current 10mA, Uf=1.20V
  R=(3.3V-1.20V)/5mA=2.1V/0.005A=420R

### Library data of the parts
IC1 = LxA710 - Solid State Relay Form A-AB:LAA710

## Module OVP
Ports: N1(pwr) N2(pwr)
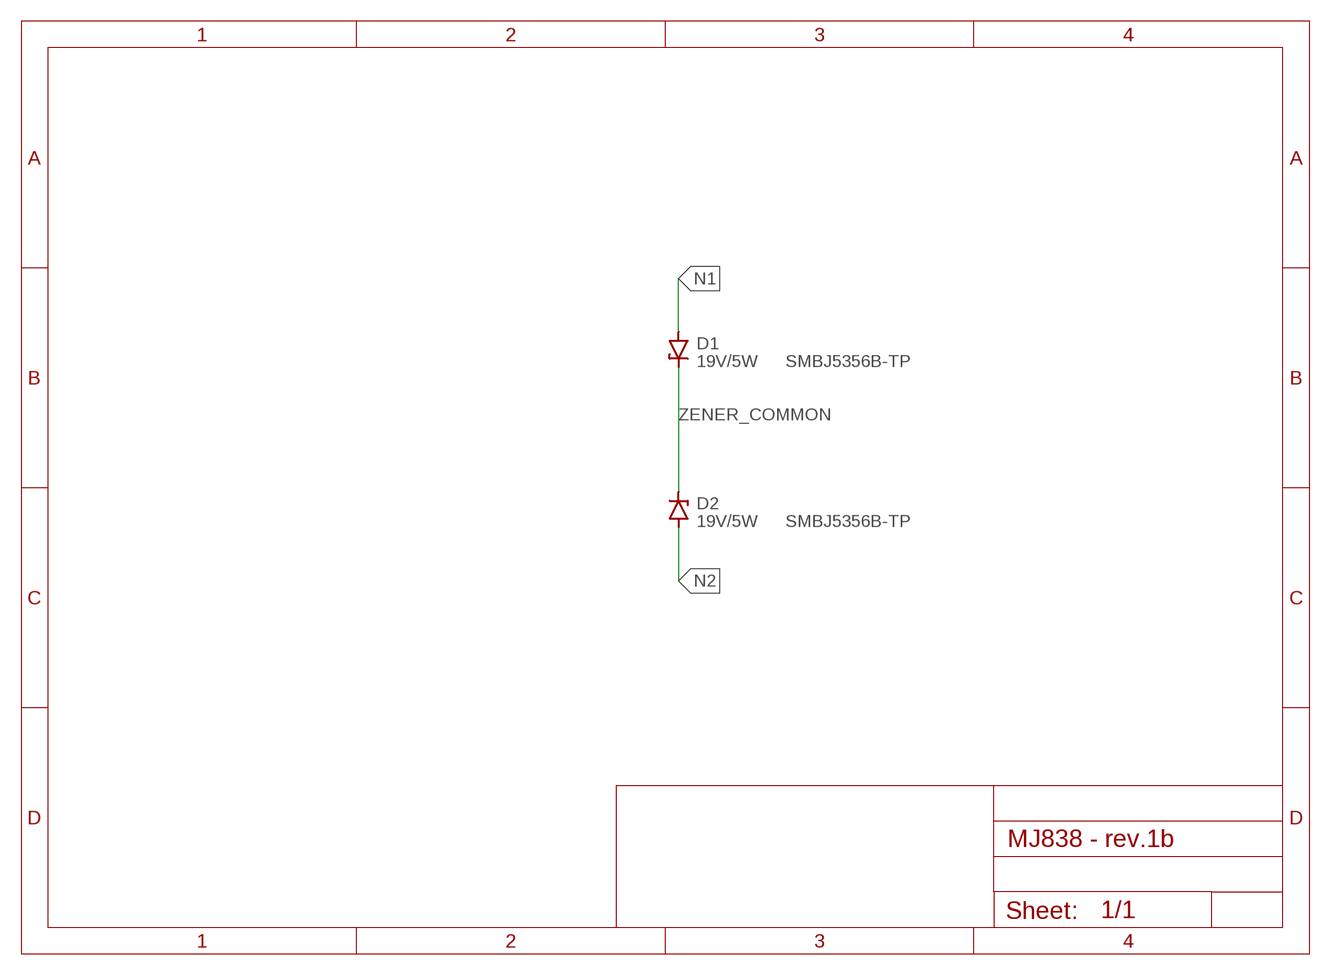
[diagram p9: schematic, module OVP, sheet 1]

### Parts
D1  19V/5W  ZENER-DIODEDO214AA  [DO214AA]
D2  19V/5W  ZENER-DIODEDO214AA  [DO214AA]

### Nets
N1 [Vdynamo]: D1.A
N2 [Vdynamo]: D2.A
ZENER_COMMON [Vdynamo]: D1.C D2.C

### Notes on the sheet
- SMBJ5356B-TP
- SMBJ5356B-TP

### Library data of the parts
D1 D2 = diode:ZENER-DIODE: Z-Diode

## Module DELON
Ports: GND(pwr) SSR_ANODE(pwr) VRECT(pwr) DELON_IN(pwr) !SW_CD!(in)
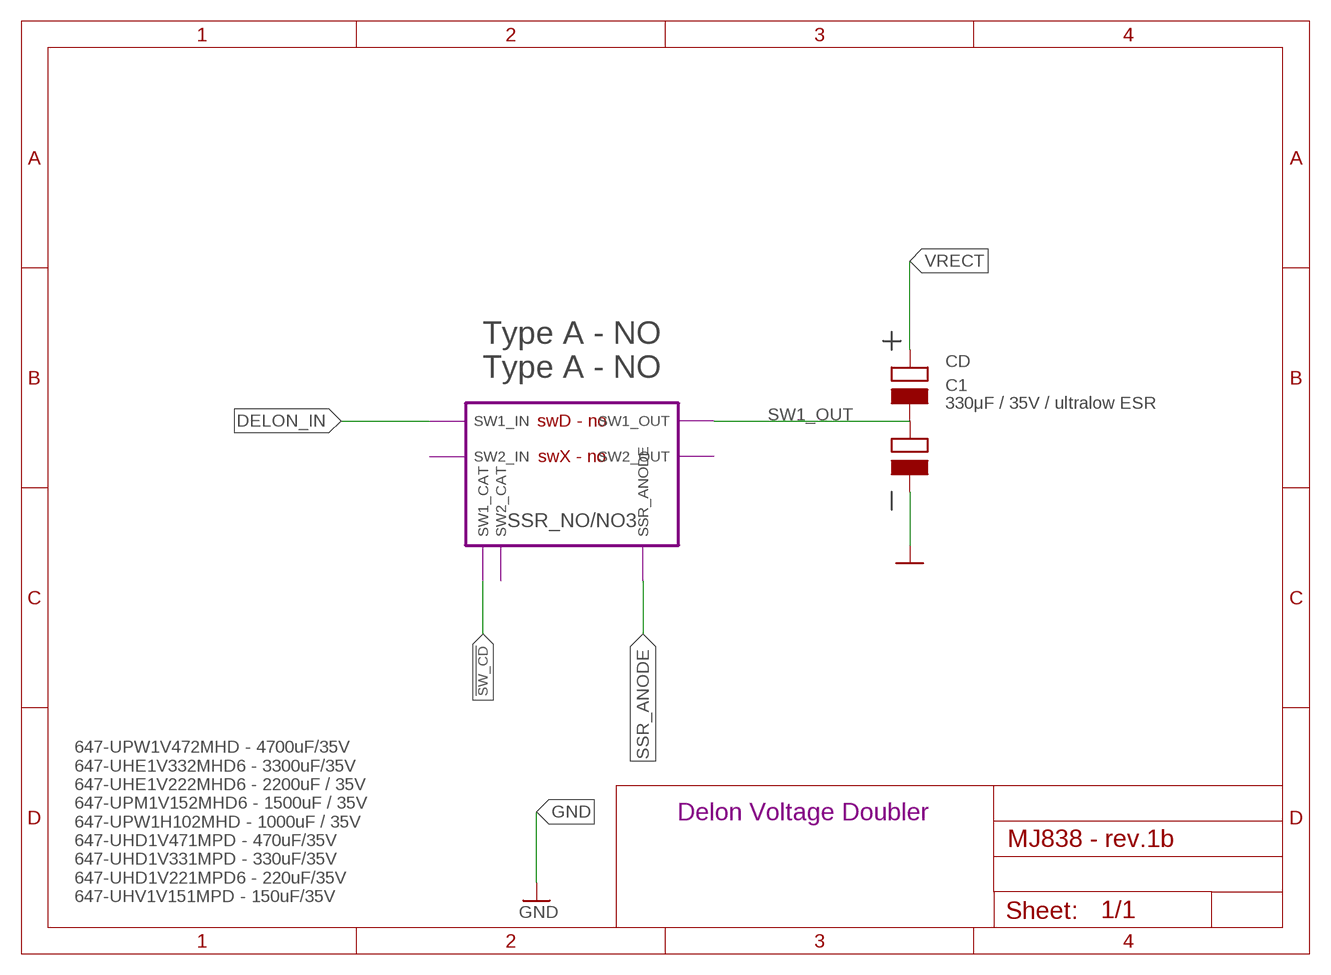
[diagram p10: schematic, module DELON, sheet 1]

### Parts
C1  330μF / 35V / ultralow ESR  C-POL-2S  [TH-2S]

### Module instances
SSR_NO/NO3 = SSR_NO/NO

### Nets
!SW_CD! [signal]: port SSR_NO/NO3.SW1_CAT
DELON_IN [Vac]: port SSR_NO/NO3.SW1_IN
GND: C1.3_NEG(NEG)
SSR_ANODE [3V3]: port SSR_NO/NO3.SSR_ANODE
SW1_OUT [Vac]: C1.2_MID(MID) ; port SSR_NO/NO3.SW1_OUT
VRECT [Vac]: C1.1_POS(POS)

### Notes on the sheet
- Type A - NO
  Type A - NO
- CD
- swD - no
- swX - no
- 647-UPW1V472MHD - 4700uF/35V
  647-UHE1V332MHD6 - 3300uF/35V
  647-UHE1V222MHD6 - 2200uF / 35V
  647-UPM1V152MHD6 - 1500uF / 35V
  647-UPW1H102MHD - 1000uF / 35V
  647-UHD1V471MPD - 470uF/35V
  647-UHD1V331MPD - 330uF/35V
  647-UHD1V221MPD6 - 220uF/35V
  647-UHV1V151MPD - 150uF/35V
- Delon Voltage Doubler

### Library data of the parts
C1 = C-Pol:C-POL-2S

## Module TUNING_CAPS
Ports: SSR_ANODE(pwr) VRECT(pwr) N1(pwr) L1(pwr) L2(pwr) !SW1!(in) !SW2!(in) !SW_CA!(in) !SW_CB!(in) !SW_CC!(in)
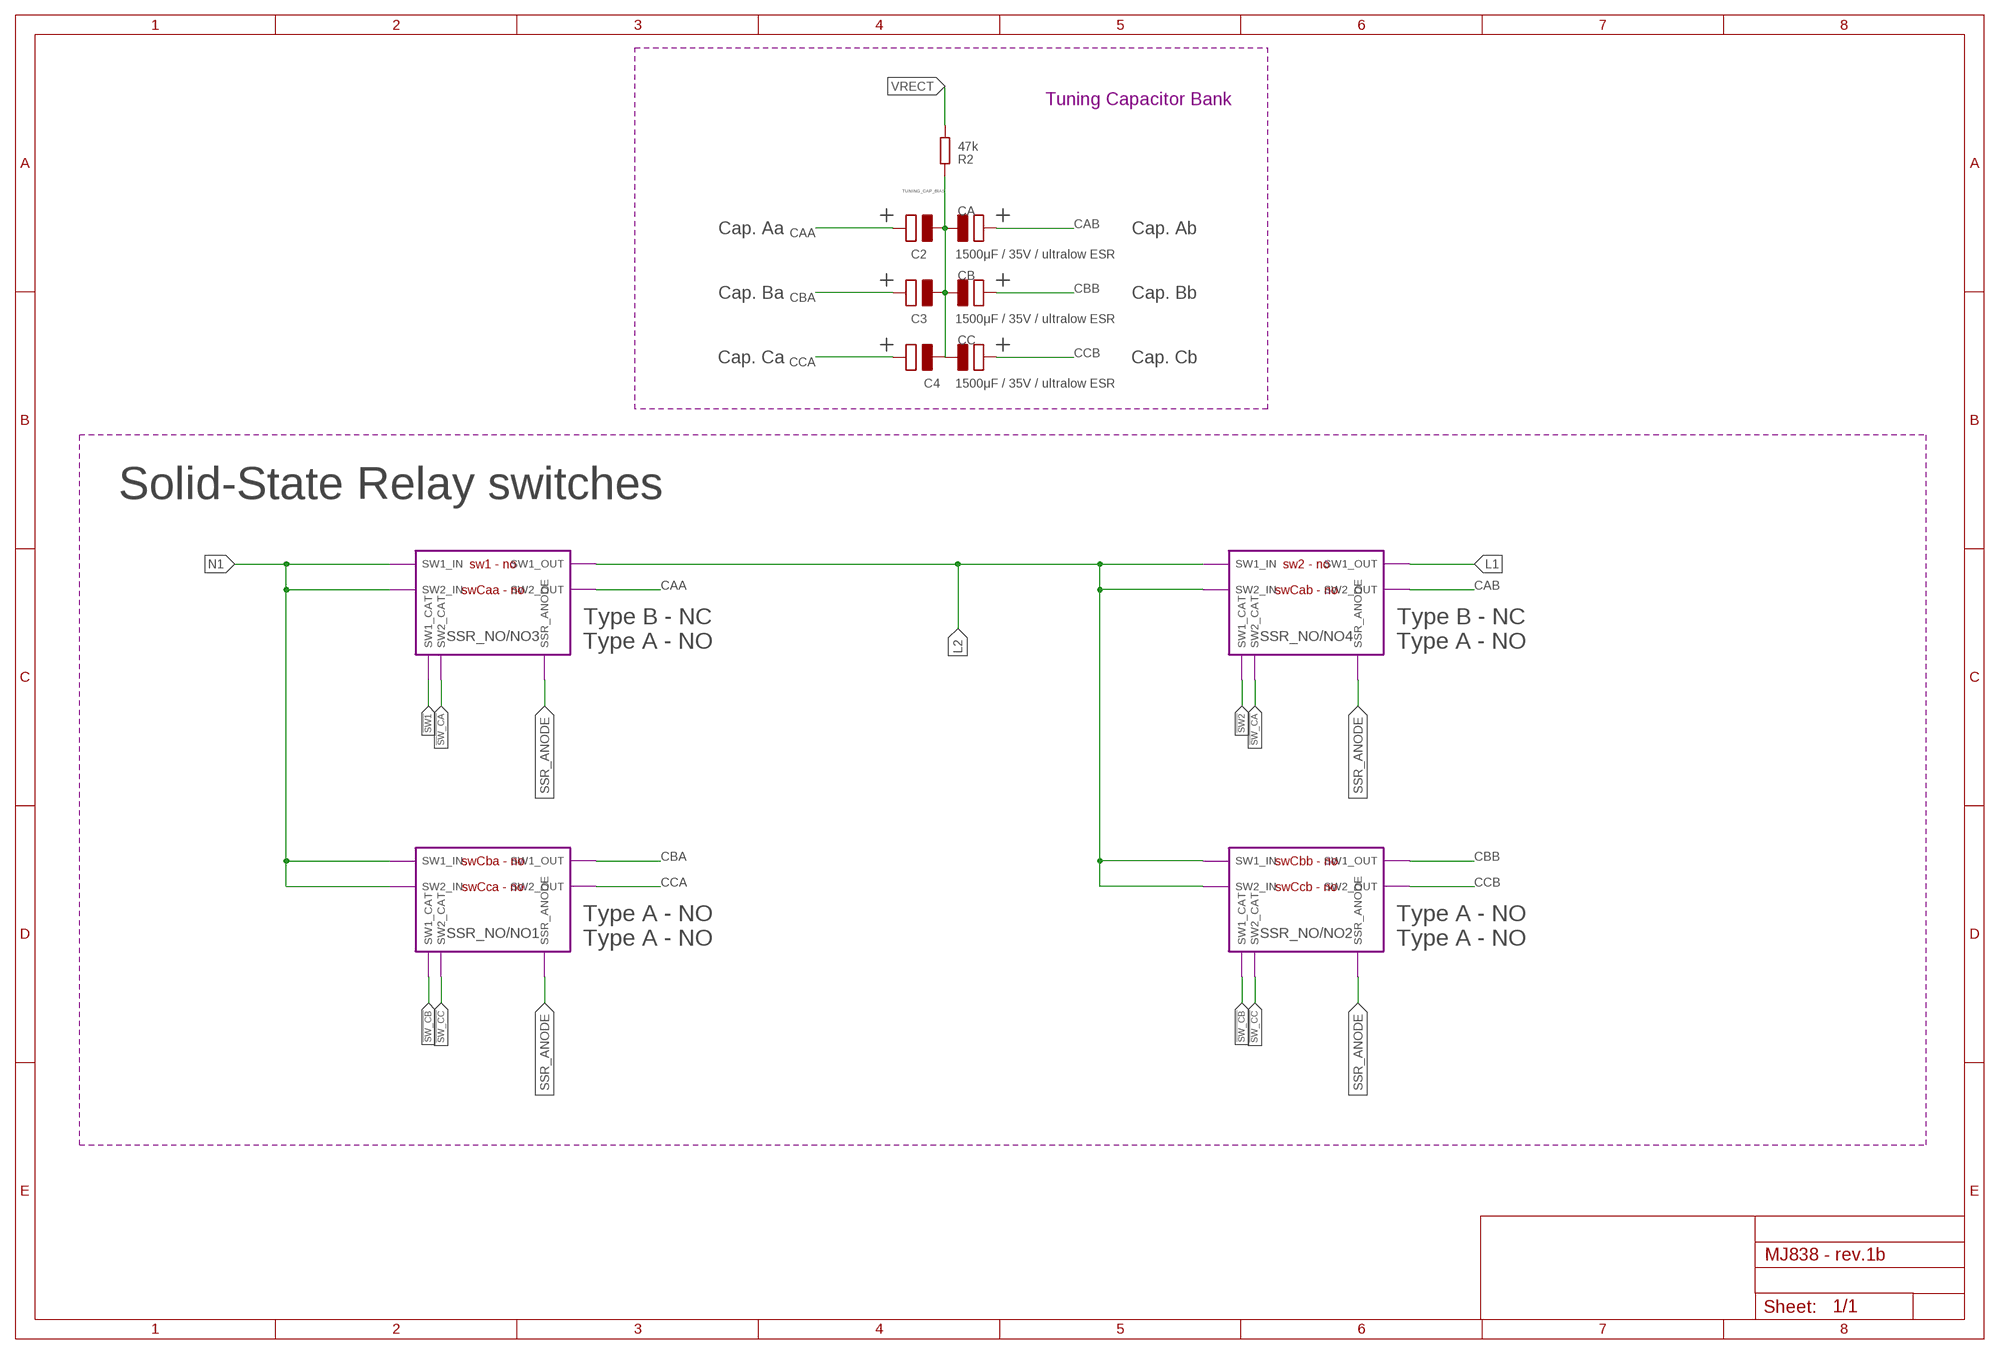
[diagram p11: schematic, module TUNING_CAPS, sheet 1]

### Parts
C2  1500μF / 35V / ultralow ESR  C-POL-2S-BACK-TO-BACK  [TH-2S-BACK-TO-BACK]
C3  1500μF / 35V / ultralow ESR  C-POL-2S-BACK-TO-BACK  [TH-2S-BACK-TO-BACK]
C4  1500μF / 35V / ultralow ESR  C-POL-2S-BACK-TO-BACK  [TH-2S-BACK-TO-BACK]
R2  47k  R-EU_R0805  [R0805]

### Module instances
SSR_NO/NO1 = SSR_NO/NO
SSR_NO/NO2 = SSR_NO/NO
SSR_NO/NO3 = SSR_NO/NO
SSR_NO/NO4 = SSR_NO/NO

### Nets
!SW1! [signal]: port SSR_NO/NO3.SW1_CAT
!SW2! [signal]: port SSR_NO/NO4.SW1_CAT
!SW_CA! [signal]: port SSR_NO/NO3.SW2_CAT SSR_NO/NO4.SW2_CAT
!SW_CB! [signal]: port SSR_NO/NO2.SW1_CAT SSR_NO/NO1.SW1_CAT
!SW_CC! [signal]: port SSR_NO/NO2.SW2_CAT SSR_NO/NO1.SW2_CAT
CAA [Vac]: C2.1_C ; port SSR_NO/NO3.SW2_OUT
CAB [Vac]: C2.3_C(2_C) ; port SSR_NO/NO4.SW2_OUT
CBA [Vac]: C3.1_C ; port SSR_NO/NO1.SW1_OUT
CBB [Vac]: C3.3_C(2_C) ; port SSR_NO/NO2.SW1_OUT
CCA [Vac]: C4.1_C ; port SSR_NO/NO1.SW2_OUT
CCB [Vac]: C4.3_C(2_C) ; port SSR_NO/NO2.SW2_OUT
L1 [Vac]: port SSR_NO/NO4.SW1_OUT
L2 [Vac]: port SSR_NO/NO2.SW1_IN SSR_NO/NO2.SW2_IN SSR_NO/NO3.SW1_OUT SSR_NO/NO4.SW1_IN SSR_NO/NO4.SW2_IN
N1 [Vdynamo]: port SSR_NO/NO1.SW1_IN SSR_NO/NO1.SW2_IN SSR_NO/NO3.SW1_IN SSR_NO/NO3.SW2_IN
SSR_ANODE [3V3]: port SSR_NO/NO3.SSR_ANODE SSR_NO/NO4.SSR_ANODE SSR_NO/NO1.SSR_ANODE SSR_NO/NO2.SSR_ANODE
TUNING_CAP_BIAS [Vac]: C2.2_MID(MID) C3.2_MID(MID) C4.2_MID(MID) R2.1
VRECT [Vac]: R2.2

### Notes on the sheet
- Tuning Capacitor Bank
- CA
- Cap. Aa | Cap. Ab
- CB
- Cap. Ba | Cap. Bb
- CC
- Cap. Ca | Cap. Cb
- Solid-State Relay switches
- sw1 - no | sw2 - no
- swCaa - no | swCab - no
- Type B - NC
  Type A - NO
- Type B - NC
  Type A - NO
- swCba - no | swCbb - no
- swCca - no | swCcb - no
- Type A - NO
  Type A - NO
- Type A - NO
  Type A - NO

### Library data of the parts
C2-C4 = C-Pol:C-POL-2S-BACK-TO-BACK
R2 = rcl:R-EU_: RESISTOR, European symbol; SPICEPREFIX: R

## Module GRAETZ+DELON
Ports: N1(pwr) N2(pwr) GND(pwr) VRECT(pwr) 3V3(pwr) SCL(in) SDA(io) !RESET!(in)
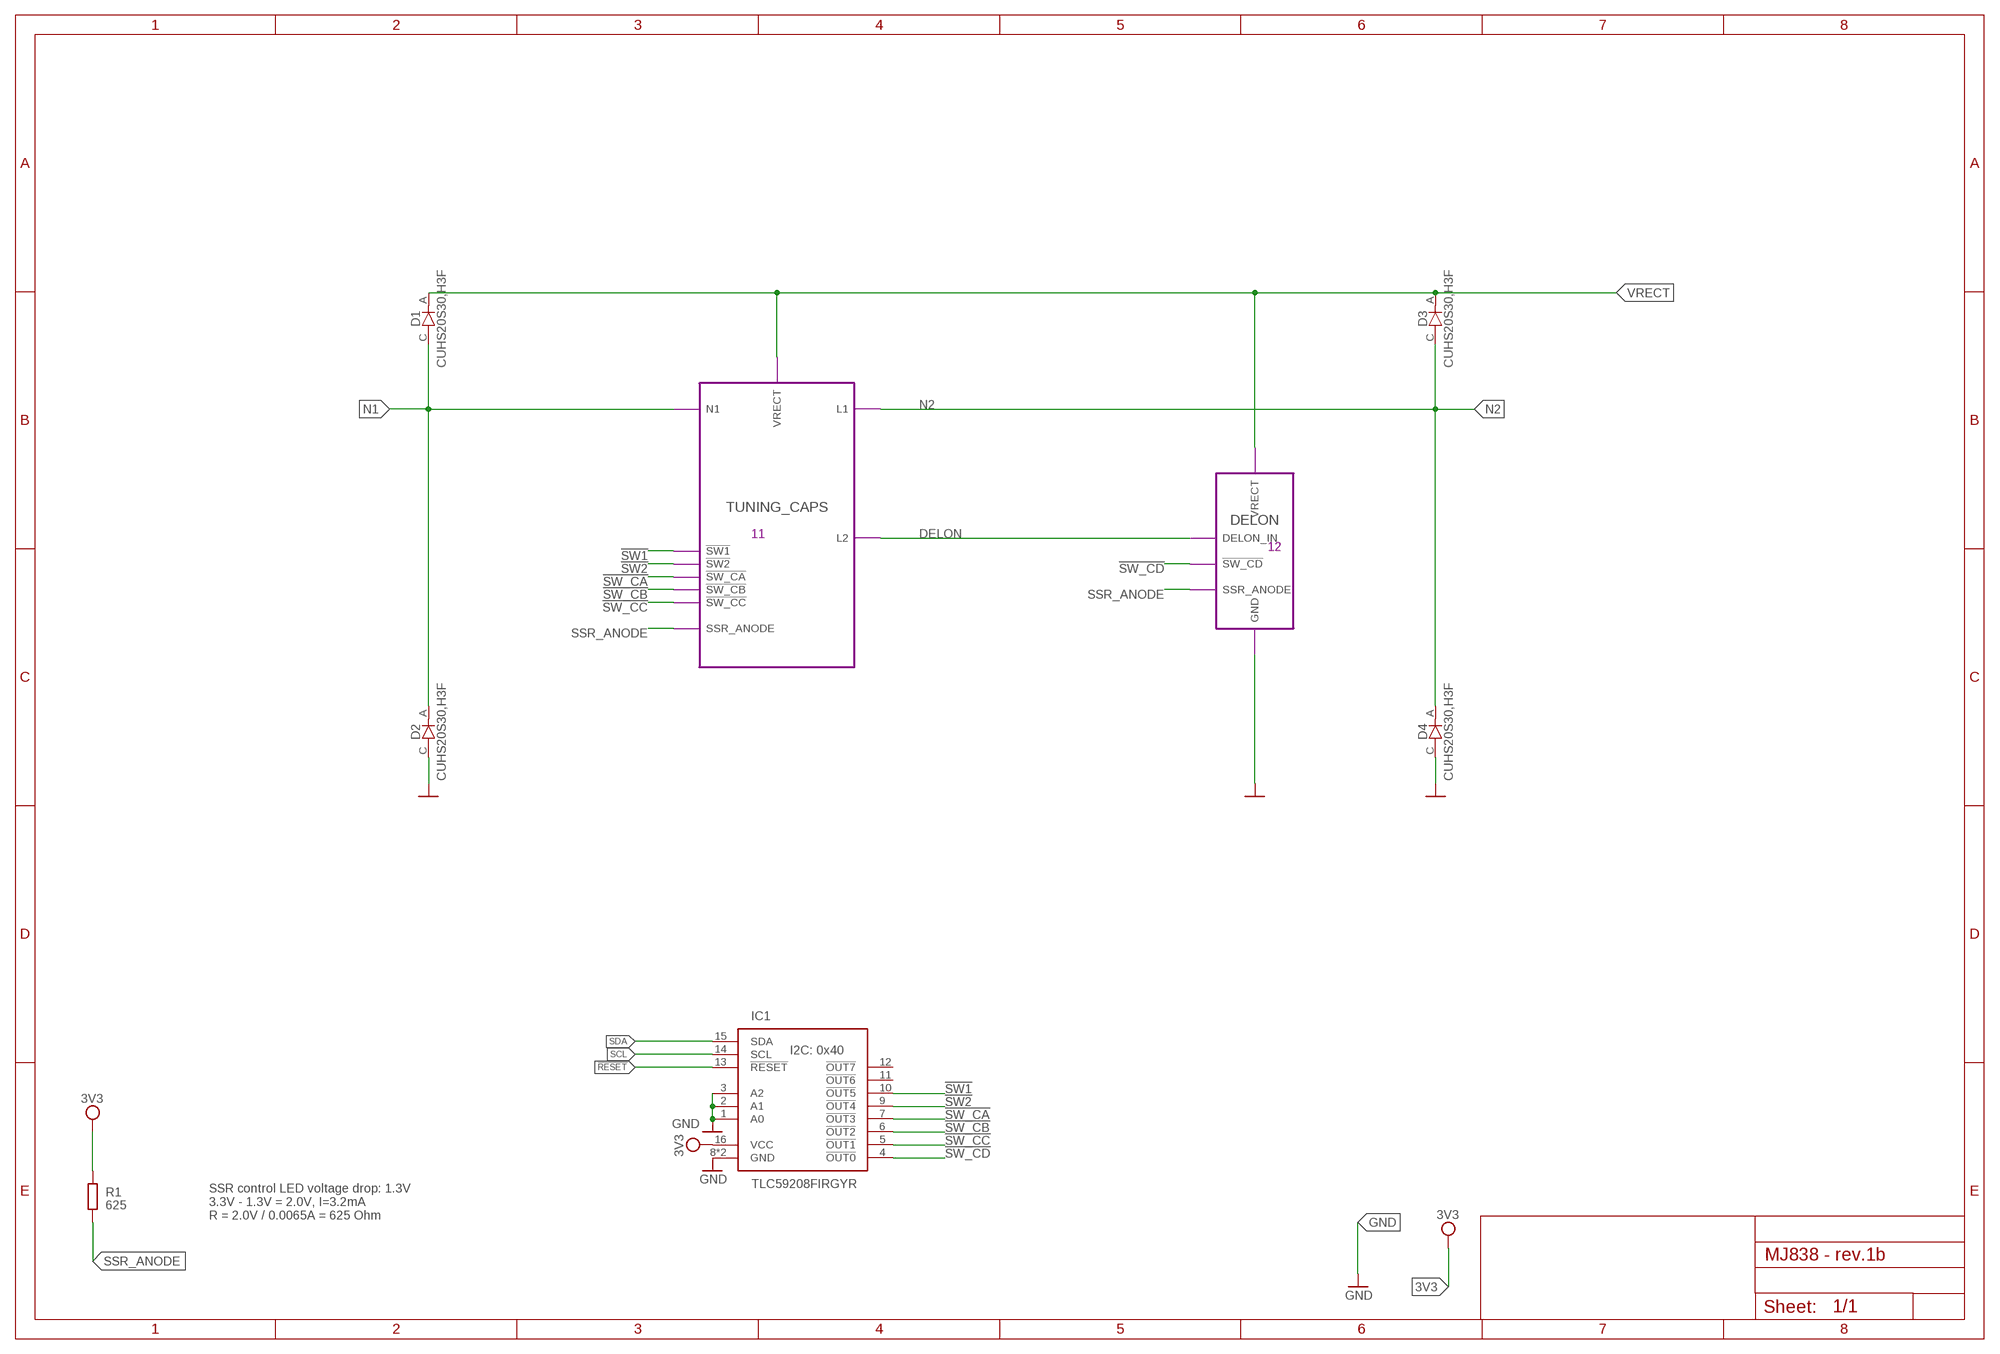
[diagram p12: schematic, module GRAETZ+DELON, sheet 1]

### Parts
D1  CUHS20S30,H3F  CUHS20S30  [US2H]
D2  CUHS20S30,H3F  CUHS20S30  [US2H]
D3  CUHS20S30,H3F  CUHS20S30  [US2H]
D4  CUHS20S30,H3F  CUHS20S30  [US2H]
IC1  TLC59208FIRGYR  TLC59208F  [VQFN16]
R1  625  R-EU_R0402  [R0402]

### Module instances
DELON = DELON
TUNING_CAPS = TUNING_CAPS

### Nets
3V3 [Vdc]: IC1.16(VCC) R1.2
!RESET! [signal]: IC1.13(!RESET!)
!SW1! [3V3]: IC1.10(!OUT5!) ; port TUNING_CAPS.!SW1!
!SW2! [3V3]: IC1.9(!OUT4!) ; port TUNING_CAPS.!SW2!
!SW_CA! [3V3]: IC1.7(!OUT3!) ; port TUNING_CAPS.!SW_CA!
!SW_CB! [3V3]: IC1.6(!OUT2!) ; port TUNING_CAPS.!SW_CB!
!SW_CC! [3V3]: IC1.5(!OUT1!) ; port TUNING_CAPS.!SW_CC!
!SW_CD! [3V3]: IC1.4(!OUT0!) ; port DELON.!SW_CD!
DELON [Vac]: port TUNING_CAPS.L2 DELON.DELON_IN
GND: D2.C D4.C IC1.1(A0) IC1.2(A1) IC1.3(A2) IC1.8(GND) IC1.17(GND) ; port DELON.GND
N1 [Vdynamo]: D1.C D2.A ; port TUNING_CAPS.N1
N2 [Vdynamo]: D3.C D4.A ; port TUNING_CAPS.L1
SCL [signal]: IC1.14(SCL)
SDA [signal]: IC1.15(SDA)
SSR_ANODE [3V3]: R1.1 ; port DELON.SSR_ANODE TUNING_CAPS.SSR_ANODE
VRECT [Vac]: D1.A D3.A ; port TUNING_CAPS.VRECT DELON.VRECT
Unconnected: IC1.11(!OUT6!) IC1.12(!OUT7!)

### Notes on the sheet
- 11
- 12
- I2C: 0x40
- SSR control LED voltage drop: 1.3V
  3.3V - 1.3V = 2.0V, I=3.2mA
  R = 2.0V / 0.0065A = 625 Ohm

### Library data of the parts
D1-D4 = CUHS20S30 - Schottky Barrier Diode:CUHS20S30
IC1 = TLC59208F - LED Driver:TLC59208F
R1 = rcl:R-EU_: RESISTOR, European symbol; SPICEPREFIX: R

## Module 12R_OHMIC_LOAD
Ports: GND(pwr) IN(pwr) SCL(in) SDA(io) 3V3(pwr)
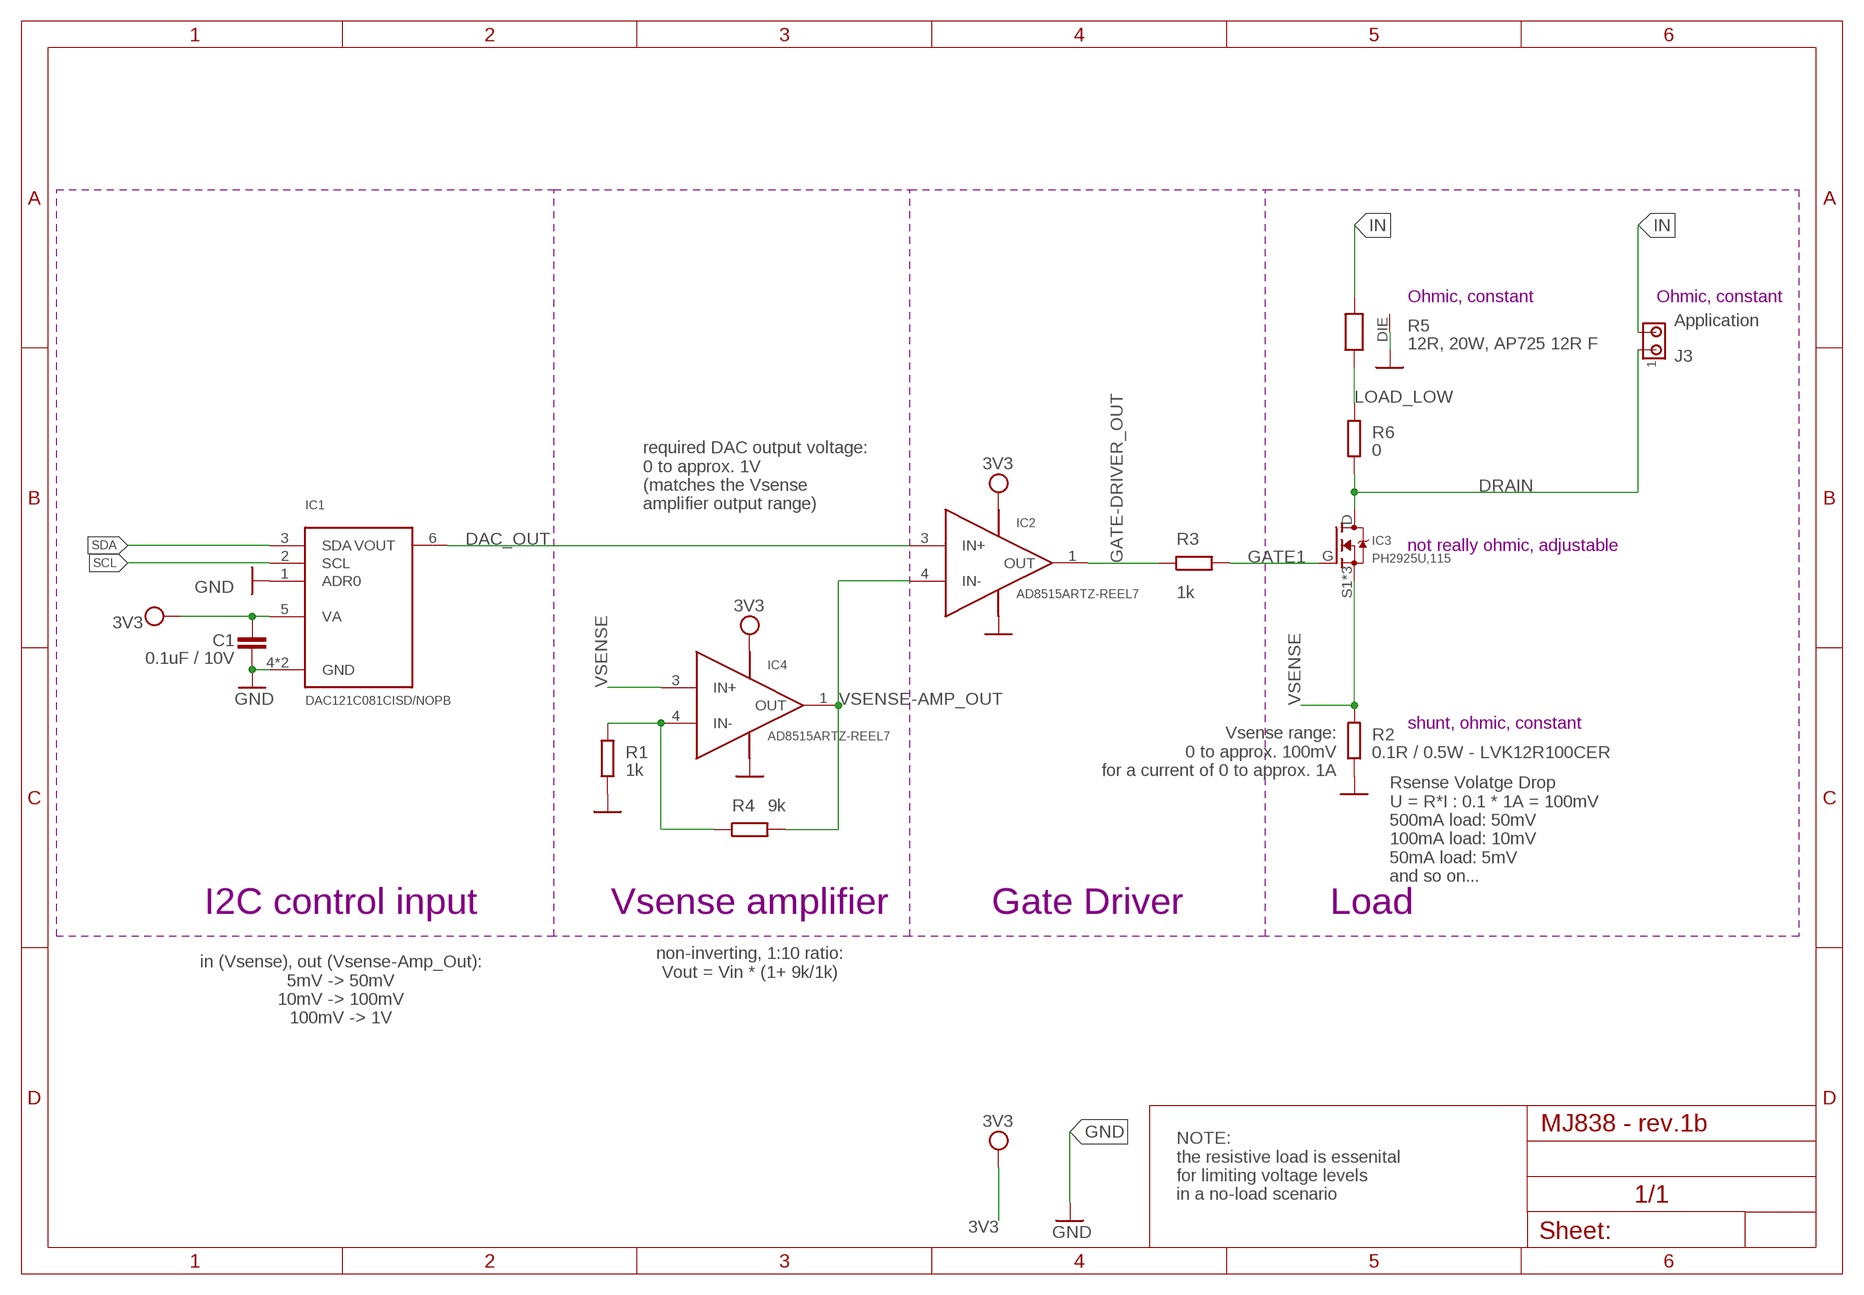
[diagram p13: schematic, module 12R_OHMIC_LOAD, sheet 1]

### Parts
C1  0.1uF / 10V  C-EUC0402  [C0402]
IC1  DAC121C081CISD/NOPB  DAC121C081  [WSON-6]
IC2  AD8515ARTZ-REEL7  AD8515  [SOT-23-5]
IC3  PH2925U,115  PH2925U  [SOT669]
IC4  AD8515ARTZ-REEL7  AD8515  [SOT-23-5]
J3  Application  MTA02-100  [10X02MTA]
R1  1k  R-EU_R0402  [R0402]
R2  0.1R / 0.5W - LVK12R100CER  R-EU_R1206  [R1206]
R3  1k  R-EU_R0402  [R0402]
R4  9k  R-EU_R0402  [R0402]
R5  12R, 20W, AP725 12R F  AP72512RF  [TO-263-2]
R6  0  R-EU_R0805  [R0805]

### Nets
3V3 [3V3]: C1.2 IC1.5(VA) IC2.5(V+) IC4.5(V+)
DAC_OUT [signal]: IC1.6(VOUT) IC2.3(IN+)
DRAIN: IC3.D J3.1 R6.1
GATE1: IC3.G R3.2
GATE-DRIVER_OUT [signal]: IC2.1(OUT) R3.1
GND: C1.1 IC1.1(ADR0) IC1.4(GND) IC1.7(GND) IC2.2(V-) IC4.2(V-) R1.1 R2.1 R5.DIE(GND)
IN [Vdc]: J3.2 R5.2
LOAD_LOW: R5.1 R6.2
N$1 [signal]: IC4.4(IN-) R1.2 R4.1
SCL [signal]: IC1.2(SCL)
SDA [signal]: IC1.3(SDA)
VSENSE [Vdc]: IC3.S1(S) IC3.S2(S) IC3.S3(S) IC4.3(IN+) R2.2
VSENSE-AMP_OUT [signal]: IC2.4(IN-) IC4.1(OUT) R4.2

### Notes on the sheet
- Ohmic, constant | Ohmic, constant
- required DAC output voltage:
  0 to approx. 1V
  (matches the Vsense
  amplifier output range)
- not really ohmic, adjustable
- shunt, ohmic, constant
- Vsense range:
  0 to approx. 100mV
  for a current of 0 to approx. 1A
- Rsense Volatge Drop
  U = R*I : 0.1 * 1A = 100mV 
  500mA load: 50mV
  100mA load: 10mV
  50mA load: 5mV
  and so on...
- I2C control input | Vsense amplifier | Gate Driver | Load
- non-inverting, 1:10 ratio:
  Vout = Vin * (1+ 9k/1k)
- in (Vsense), out (Vsense-Amp_Out):
  5mV -> 50mV
  10mV -> 100mV
  100mV -> 1V
- NOTE:
  the resistive load is essenital 
  for limiting voltage levels
  in a no-load scenario

### Library data of the parts
C1 = rcl:C-EU: CAPACITOR, European symbol; SPICEPREFIX: C
IC1 = DA121C081 - 12bit I2C DAC:DAC121C081
IC2 IC4 = AD8515 - R2R IO OpAmp:AD8515
IC3 = PH2925U - N-Fet:PH2925U
J3 = con-amp:MTA02-100: AMP connector
R1-R4 R6 = rcl:R-EU_: RESISTOR, European symbol; SPICEPREFIX: R
R5 = AP725 12R F - 12R 20W Resistor:AP72512RF

## Module FE-RAM
Ports: GND(pwr) 3V3(pwr) I2C_SCL(in) I2C_SDA(io) WP(hiz)
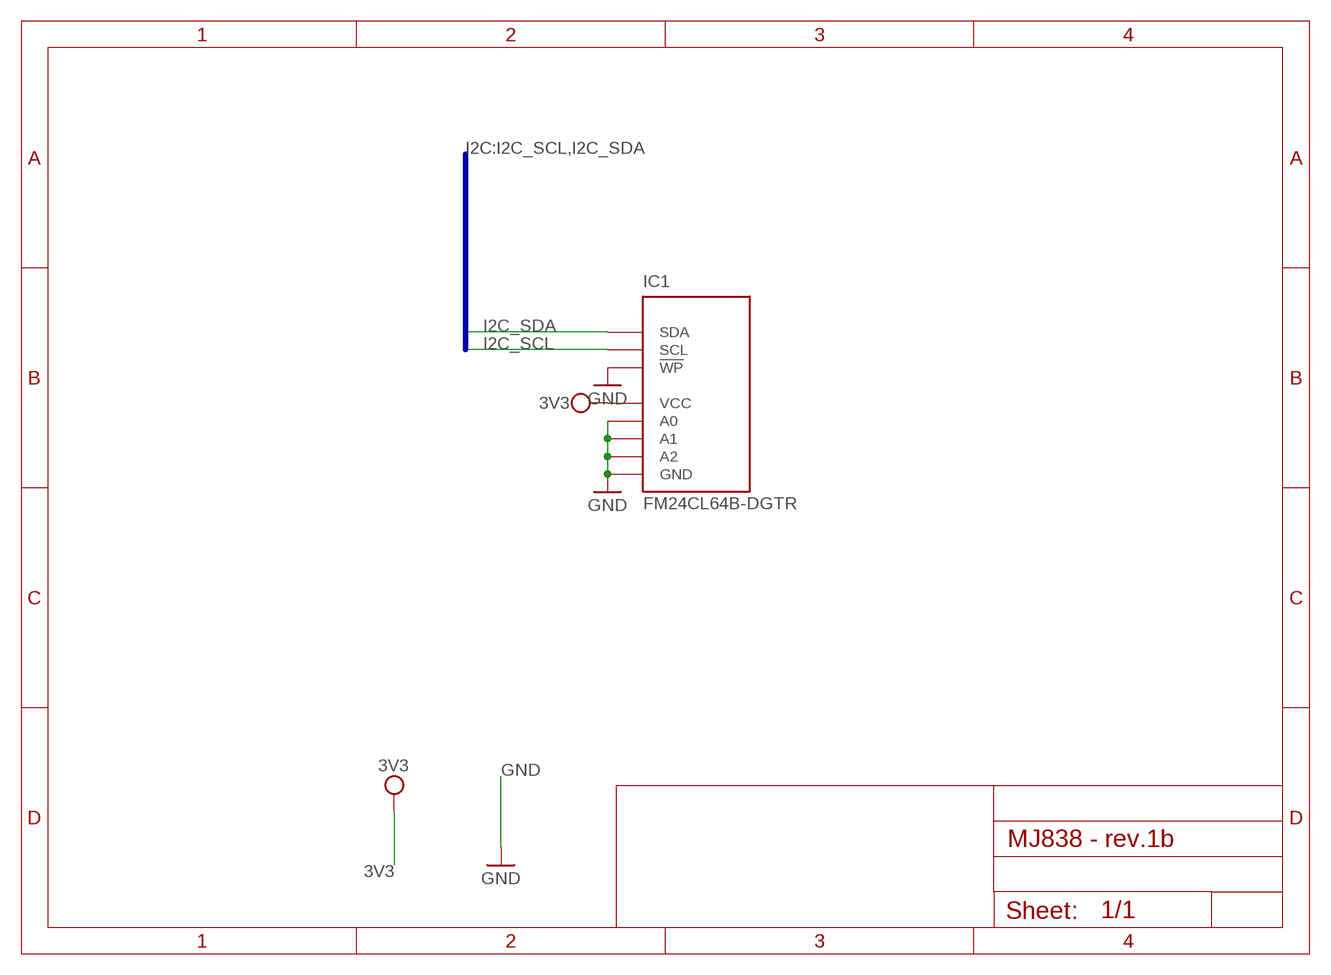
[diagram p14: schematic, module FE-RAM, sheet 1]

### Parts
IC1  FM24CL64B-DGTR  FM24CL64B  [DFN8]

### Nets
3V3 [3V3]: IC1.8(VCC)
GND: IC1.1(A0) IC1.2(A1) IC1.3(A2) IC1.4(GND) IC1.7(!WP!) IC1.G(GND)
I2C_SCL [signal]: IC1.6(SCL)
I2C_SDA [signal]: IC1.5(SDA)

### Buses
I2C:I2C_SCL,I2C_SDA

### Library data of the parts
IC1 = FM24CL64B - 64kb I2C FeRAM:FM24CL64B

## Module HUMIDITY
Ports: GND(pwr) 3V3(pwr) SCL(in) SDA(io)
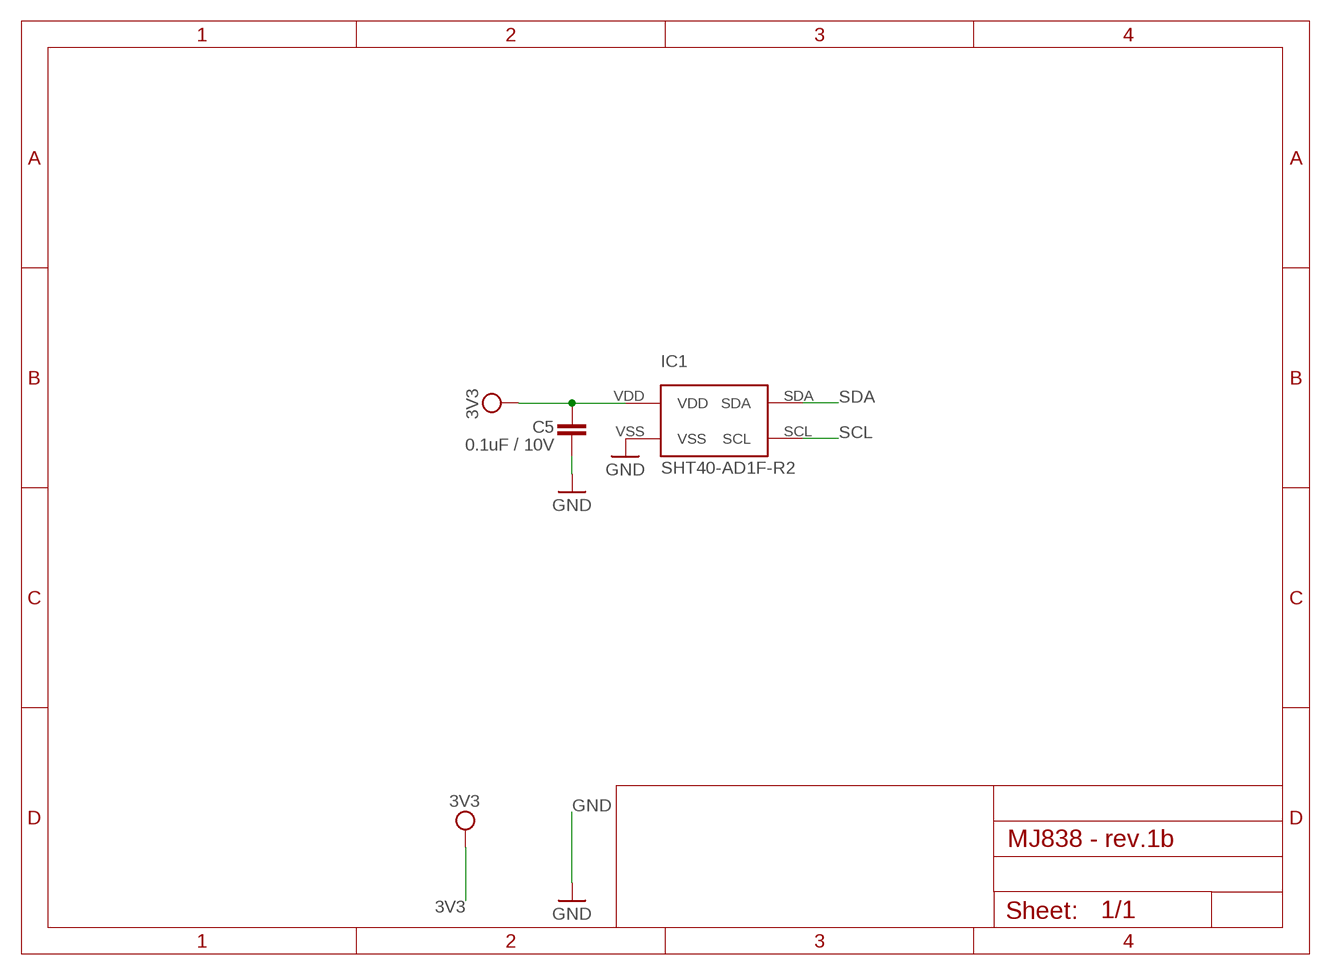
[diagram p15: schematic, module HUMIDITY, sheet 1]

### Parts
C5  0.1uF / 10V  C-EUC0402  [C0402]
IC1  SHT40-AD1F-R2  SHT40  [SMD]

### Nets
3V3 [3V3]: C5.1 IC1.VDD
GND: C5.2 IC1.VSS
SCL [signal]: IC1.SCL
SDA [signal]: IC1.SDA

### Library data of the parts
C5 = rcl:C-EU: CAPACITOR, European symbol; SPICEPREFIX: C
IC1 = SHT40-AD1F - Humidity Sensor:SHT40

## Module INA219
Ports: GND(pwr) 3V3(pwr) A0(hiz) A1(hiz) IN+(in) IN-(out) SCL(in) SDA(io)
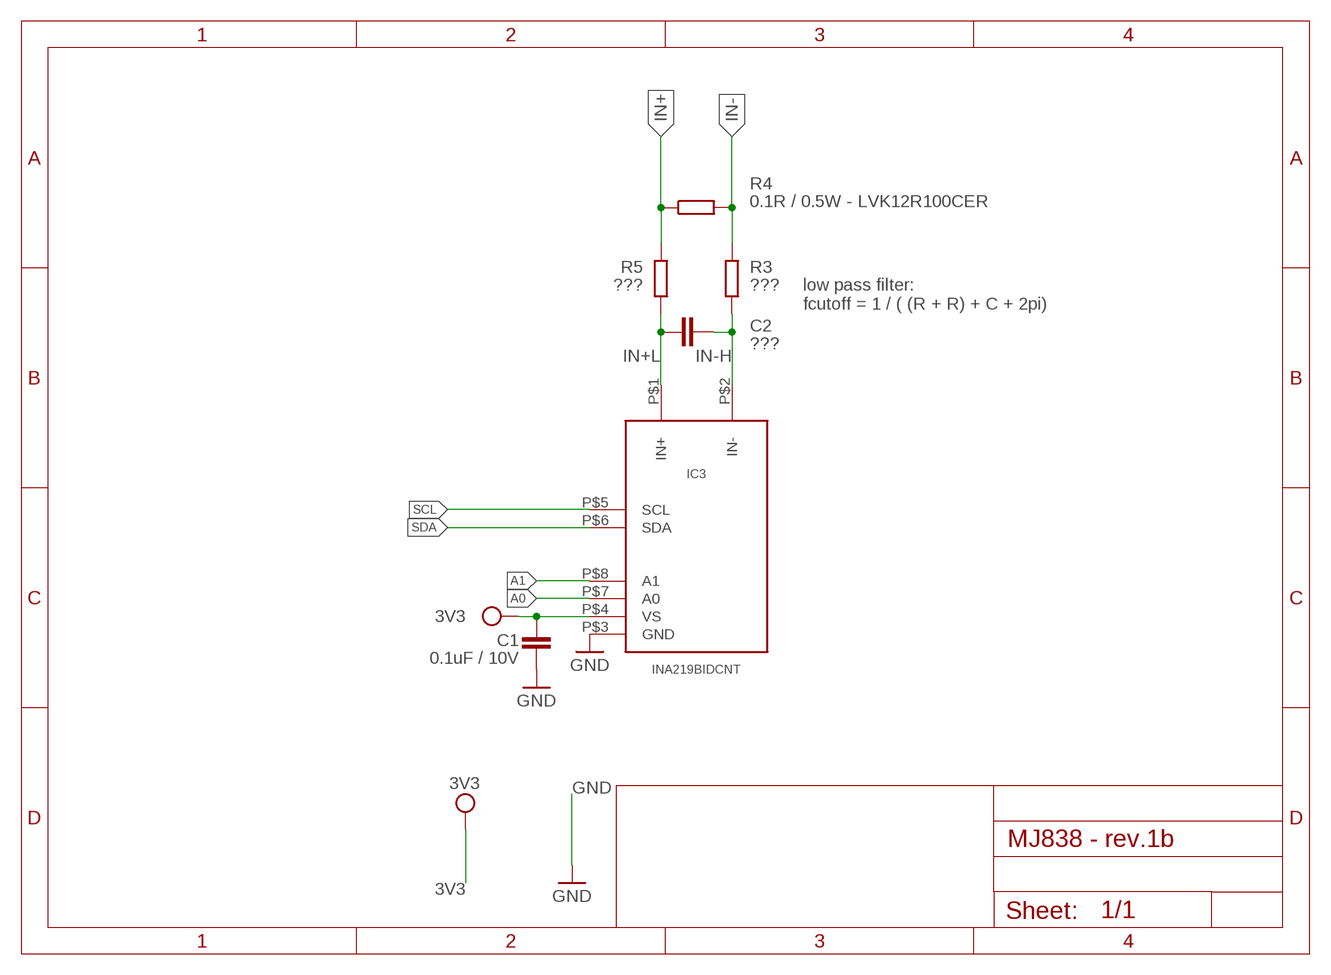
[diagram p16: schematic, module INA219, sheet 1]

### Parts
C1  0.1uF / 10V  C-EUC0402  [C0402]
C2  ???  C-EUC0402  [C0402]
IC3  INA219BIDCNT  INA219  [SOT-23-8]
R3  ???  R-EU_R0402  [R0402]
R4  0.1R / 0.5W - LVK12R100CER  R-EU_R1206  [R1206]
R5  ???  R-EU_R0402  [R0402]

### Nets
3V3 [3V3]: C1.1 IC3.P$4(VS)
A0 [signal]: IC3.P$7(A0)
A1 [signal]: IC3.P$8(A1)
GND: C1.2 IC3.P$3(GND)
IN+ [signal]: R4.1 R5.2
IN+L [signal]: C2.1 IC3.P$1(IN+) R5.1
IN- [signal]: R3.2 R4.2
IN-H [signal]: C2.2 IC3.P$2(IN-) R3.1
SCL [signal]: IC3.P$5(SCL)
SDA [signal]: IC3.P$6(SDA)

### Notes on the sheet
- low pass filter:
  fcutoff = 1 / ( (R + R) + C + 2pi)

### Library data of the parts
C1 C2 = rcl:C-EU: CAPACITOR, European symbol; SPICEPREFIX: C
IC3 = INA219 - I2C Current & Power Monitor:INA219
R3-R5 = rcl:R-EU_: RESISTOR, European symbol; SPICEPREFIX: R

## Module PHASE_SHIFT
Ports: GND(pwr) 3V3(pwr) HI(in) LO(out) OUT(out)
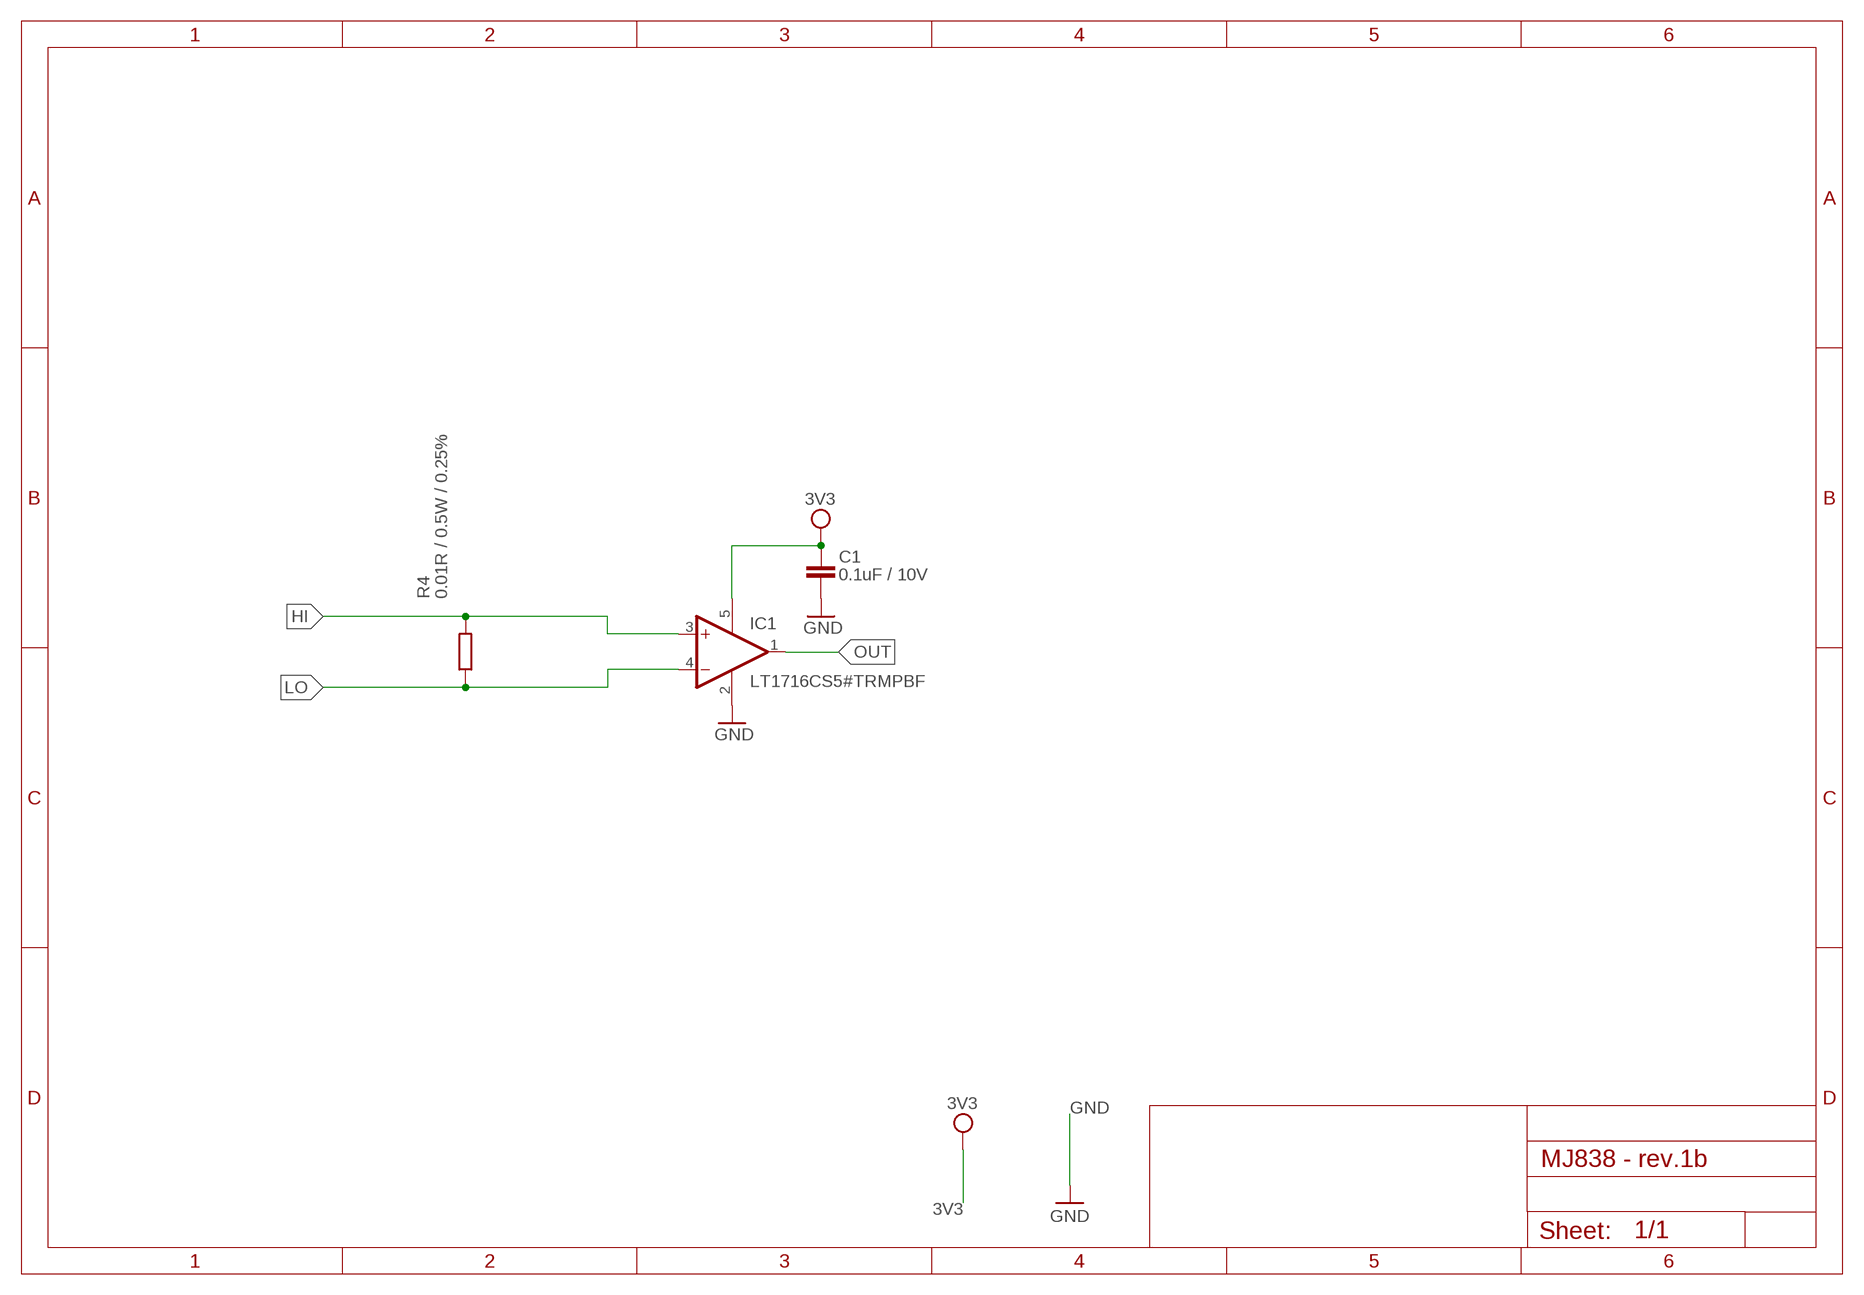
[diagram p17: schematic, module PHASE_SHIFT, sheet 1]

### Parts
C1  0.1uF / 10V  C-EUC0402  [C0402]
IC1  LT1716CS5#TRMPBF  OPA344N-SOT23  [SOT23-5]
R4  0.01R / 0.5W / 0.25%  R-EU_R1206  [R1206]

### Nets
3V3 [3V3]: C1.2 IC1.5(V+)
GND: C1.1 IC1.2(V-)
HI [signal]: IC1.3(+IN) R4.2
LO [signal]: IC1.4(-IN) R4.1
OUT [signal]: IC1.1(OUT)

### Library data of the parts
C1 = rcl:C-EU: CAPACITOR, European symbol; SPICEPREFIX: C
IC1 = linear:OPA*-SOT23: Single Operational Amplifier Low Power, Single-Supply, Rail-To-Rail Operational Amplifier Source: http://focus.ti.com/lit/ds/symlink/opa2345.pdf
R4 = rcl:R-EU_: RESISTOR, European symbol; SPICEPREFIX: R

## Module RECTIFIER
Ports: GND(pwr) ZEROCROSS(out) 3V3(pwr) N1(pwr) N2(pwr) VDC(pwr) BAT(pwr) SCL(in) SDA(io) !LED_RESET!(in) PHASE(out)
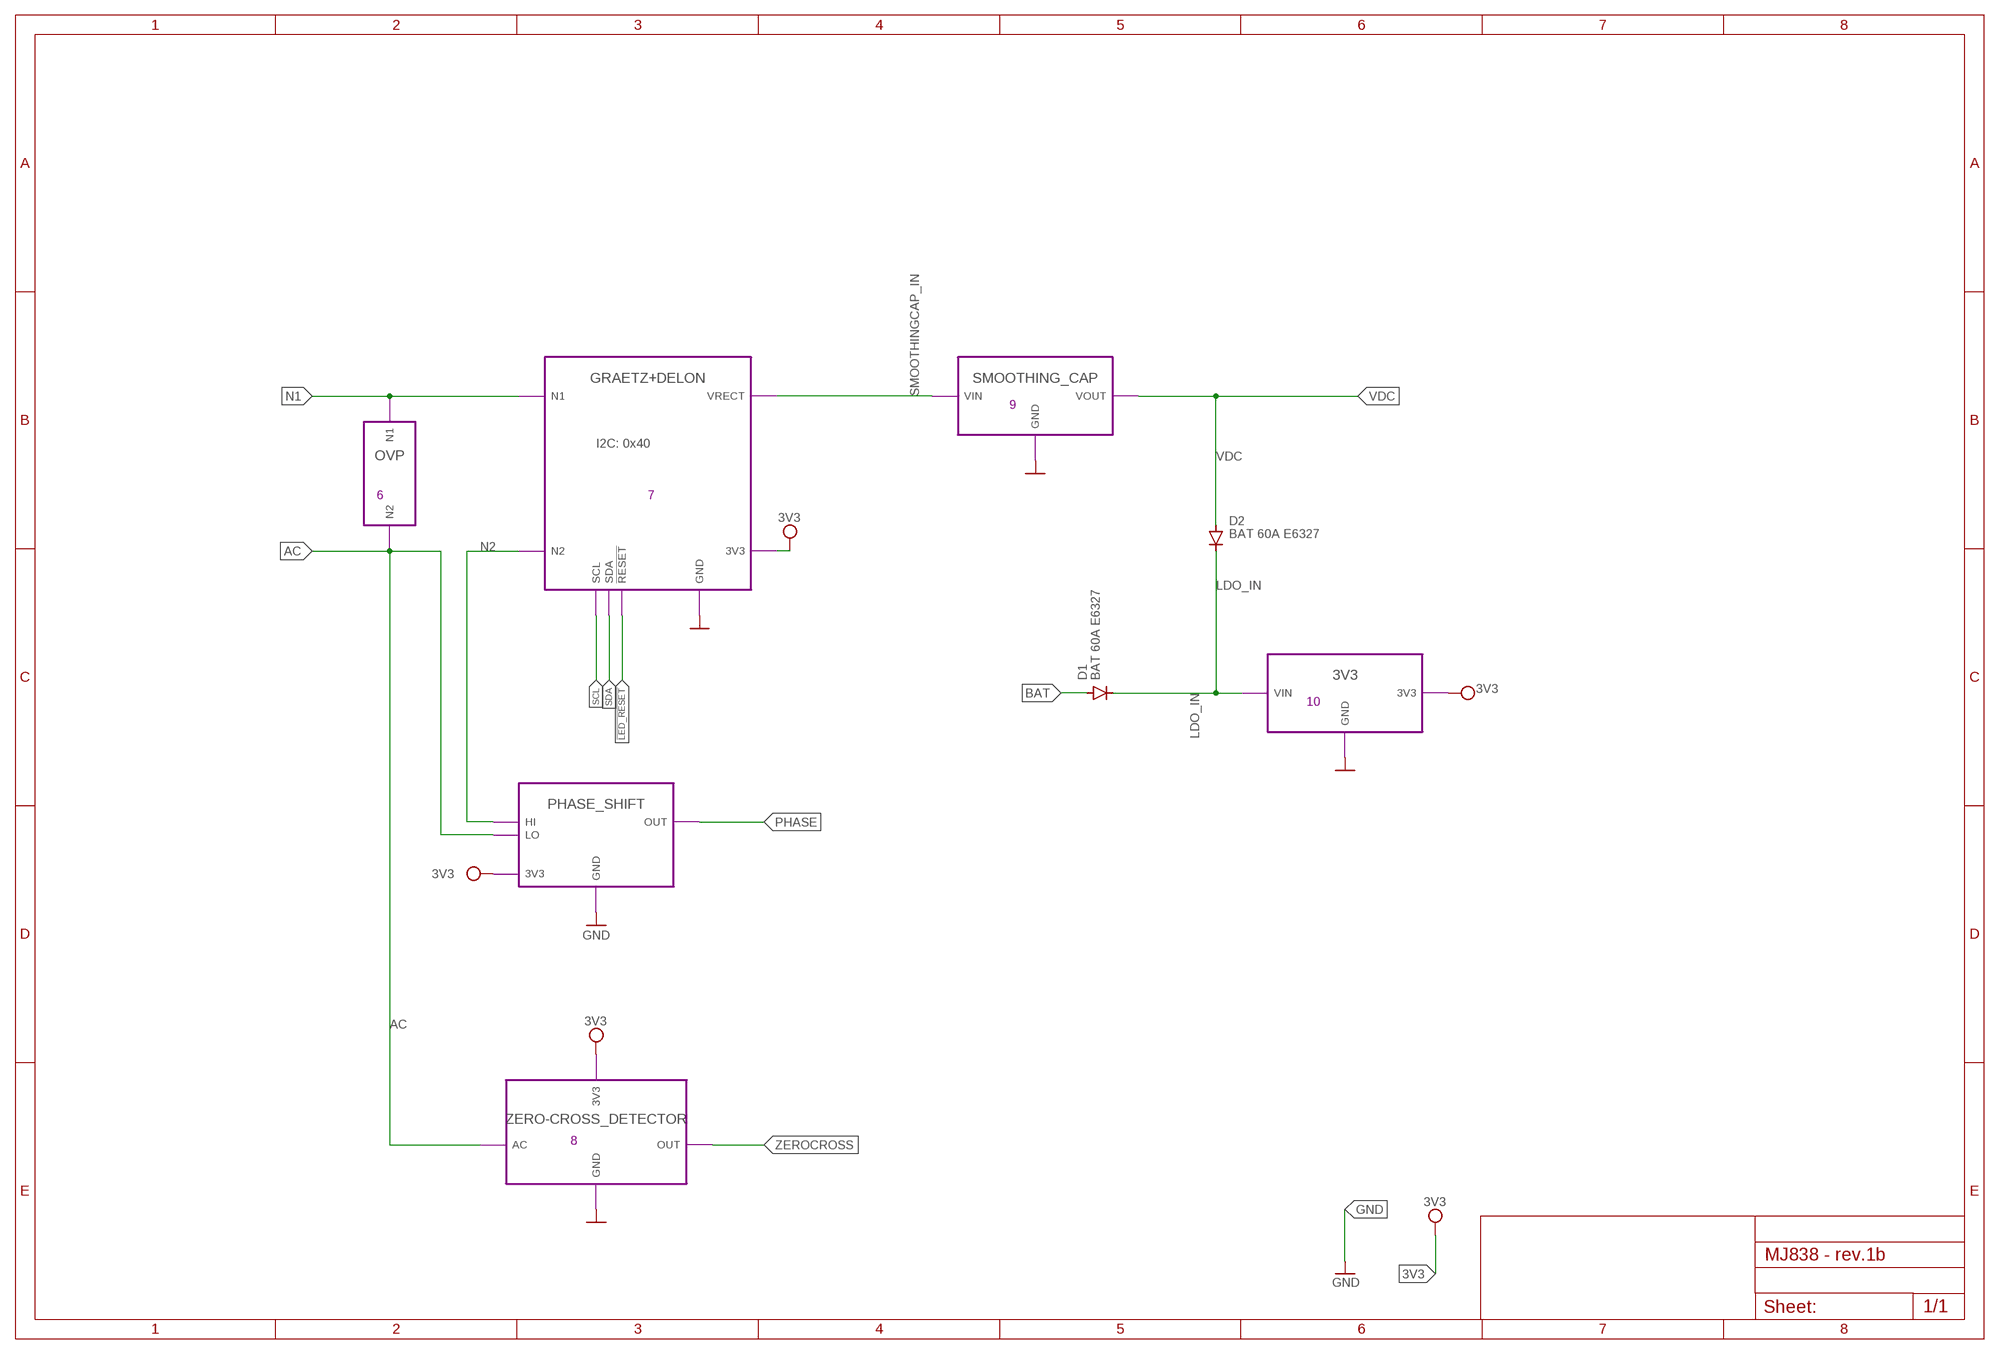
[diagram p18: schematic, module RECTIFIER, sheet 1]

### Parts
D1  BAT 60A E6327  DIODE-SOD323-W  [SOD323-W]
D2  BAT 60A E6327  DIODE-SOD323-W  [SOD323-W]

### Module instances
OVP = OVP
ZERO-CROSS_DETECTOR = ZERO-CROSS_DETECTOR
3V3 = 3V3
SMOOTHING_CAP = SMOOTHING_CAP
GRAETZ+DELON = GRAETZ+DELON
PHASE_SHIFT = PHASE_SHIFT

### Nets
3V3 [3V3]: port ZERO-CROSS_DETECTOR.3V3 3V3.3V3 GRAETZ+DELON.3V3 PHASE_SHIFT.3V3
!LED_RESET! [signal]: port GRAETZ+DELON.!RESET!
AC [Vdynamo]: port ZERO-CROSS_DETECTOR.AC OVP.N2 PHASE_SHIFT.LO
BAT [BAT+]: D1.A
GND: port ZERO-CROSS_DETECTOR.GND 3V3.GND SMOOTHING_CAP.GND GRAETZ+DELON.GND PHASE_SHIFT.GND
LDO_IN [BAT+]: D1.C D2.C ; port 3V3.VIN
N1 [Vdynamo]: port OVP.N1 GRAETZ+DELON.N1
N2 [Vdynamo]: port GRAETZ+DELON.N2 PHASE_SHIFT.HI
PHASE [signal]: port PHASE_SHIFT.OUT
SCL [signal]: port GRAETZ+DELON.SCL
SDA [signal]: port GRAETZ+DELON.SDA
SMOOTHINGCAP_IN [Vac]: port SMOOTHING_CAP.VIN GRAETZ+DELON.VRECT
VDC [Vdc]: D2.A ; port SMOOTHING_CAP.VOUT
ZEROCROSS [signal]: port ZERO-CROSS_DETECTOR.OUT

### Notes on the sheet
- 9
- I2C: 0x40
- 6 | 7
- 10
- 8

### Library data of the parts
D1 D2 = diode:DIODE-: DIODE

## Module SD_CARD
Ports: GND(pwr) 3V3(pwr) MISO(out) MOSI(in) CLK(in) CS(in) DET(hiz)
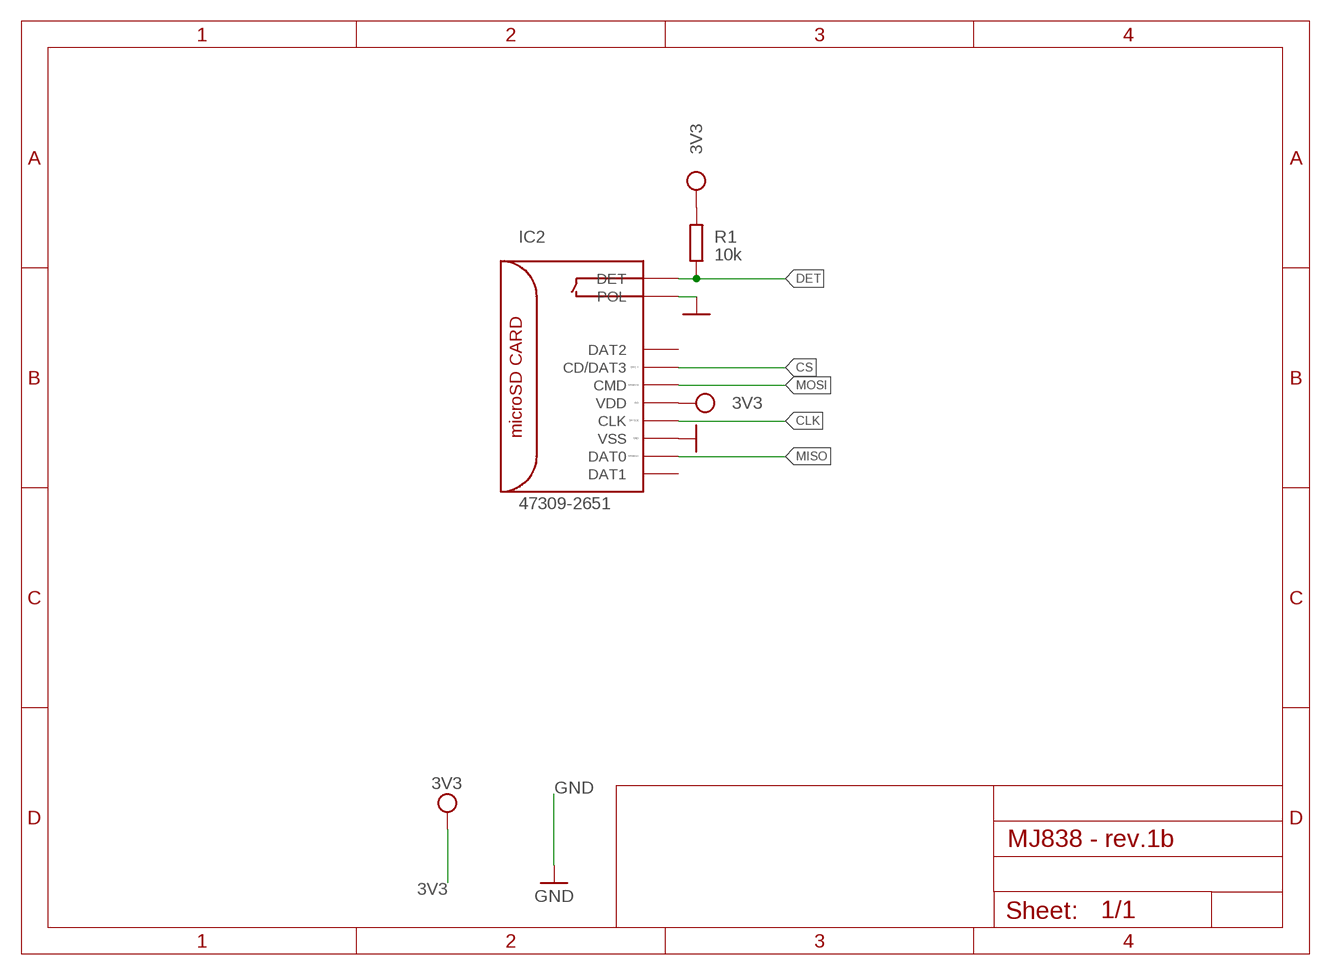
[diagram p19: schematic, module SD_CARD, sheet 1]

### Parts
IC2  47309-2651  MICROSD_SPI_MODE  [MICRO_SD_CONNECTOR]
R1  10k  R-EU_R0402  [R0402]

### Nets
3V3 [3V3]: IC2.VDD R1.2
CLK: IC2.CLK
CS: IC2.CD/DAT3
DET: IC2.DET R1.1
GND: IC2.GND1(VSS) IC2.GND2(VSS) IC2.GND3(VSS) IC2.POL
MISO: IC2.DAT0
MOSI: IC2.CMD
Unconnected: IC2.DAT1 IC2.DAT2

### Library data of the parts
IC2 = Molex SD-47309 SD Card Slot:MICROSD_SPI_MODE: MOLEX - 49225-0821 - CONNECTEUR MICRO SD PUSH/PUSH REV Fabricant: MOLEX Code commande Farnell: 1366700 <http://fr.farnell.com/molex/49225-0821/connecteur-micro-sd-push-push-rev/dp/1366700?Ntt=1366700> Référence fabricant: 49225-0821
R1 = rcl:R-EU_: RESISTOR, European symbol; SPICEPREFIX: R

## Net classes
0 GND: width 0.25 mm, drill 0.35 mm, clearance 0.19 mm
1 BAT+: width 0.5 mm, drill 0.35 mm, clearance 0.5 mm to class 0, clearance 0.5 mm
2 signal: width 0.25 mm, drill 0.35 mm, clearance 0.19 mm to class 0, clearance 0.19 mm to class 1, clearance 0.19 mm
3 3V3: width 0.25 mm, drill 0.35 mm, clearance 0.19 mm to class 0, clearance 0.19 mm to class 1, clearance 0.19 mm to class 2, clearance 0.19 mm
4 Vdc: width 0.5 mm, drill 0.35 mm, clearance 0.5 mm to class 0, clearance 0.5 mm to class 1, clearance 0.5 mm to class 2, clearance 0.5 mm to class 3, clearance 0.5 mm
5 Vdynamo: width 0.5 mm, drill 0.35 mm, clearance 0.5 mm to class 0, clearance 0.5 mm to class 1, clearance 0.5 mm to class 2, clearance 0.5 mm to class 3, clearance 0.5 mm to class 4, clearance 0.5 mm
6 Vac: width 0.5 mm, drill 0.35 mm, clearance 0.5 mm to class 0, clearance 0.5 mm to class 1, clearance 0.5 mm to class 2, clearance 0.5 mm to class 3, clearance 0.5 mm to class 4, clearance 0.5 mm to class 5, clearance 0.5 mm